# EAGLE design TESTOMATIC-v2_0 (EAGLE 9.7.0)

## Sheet 1 of 4: External Connections
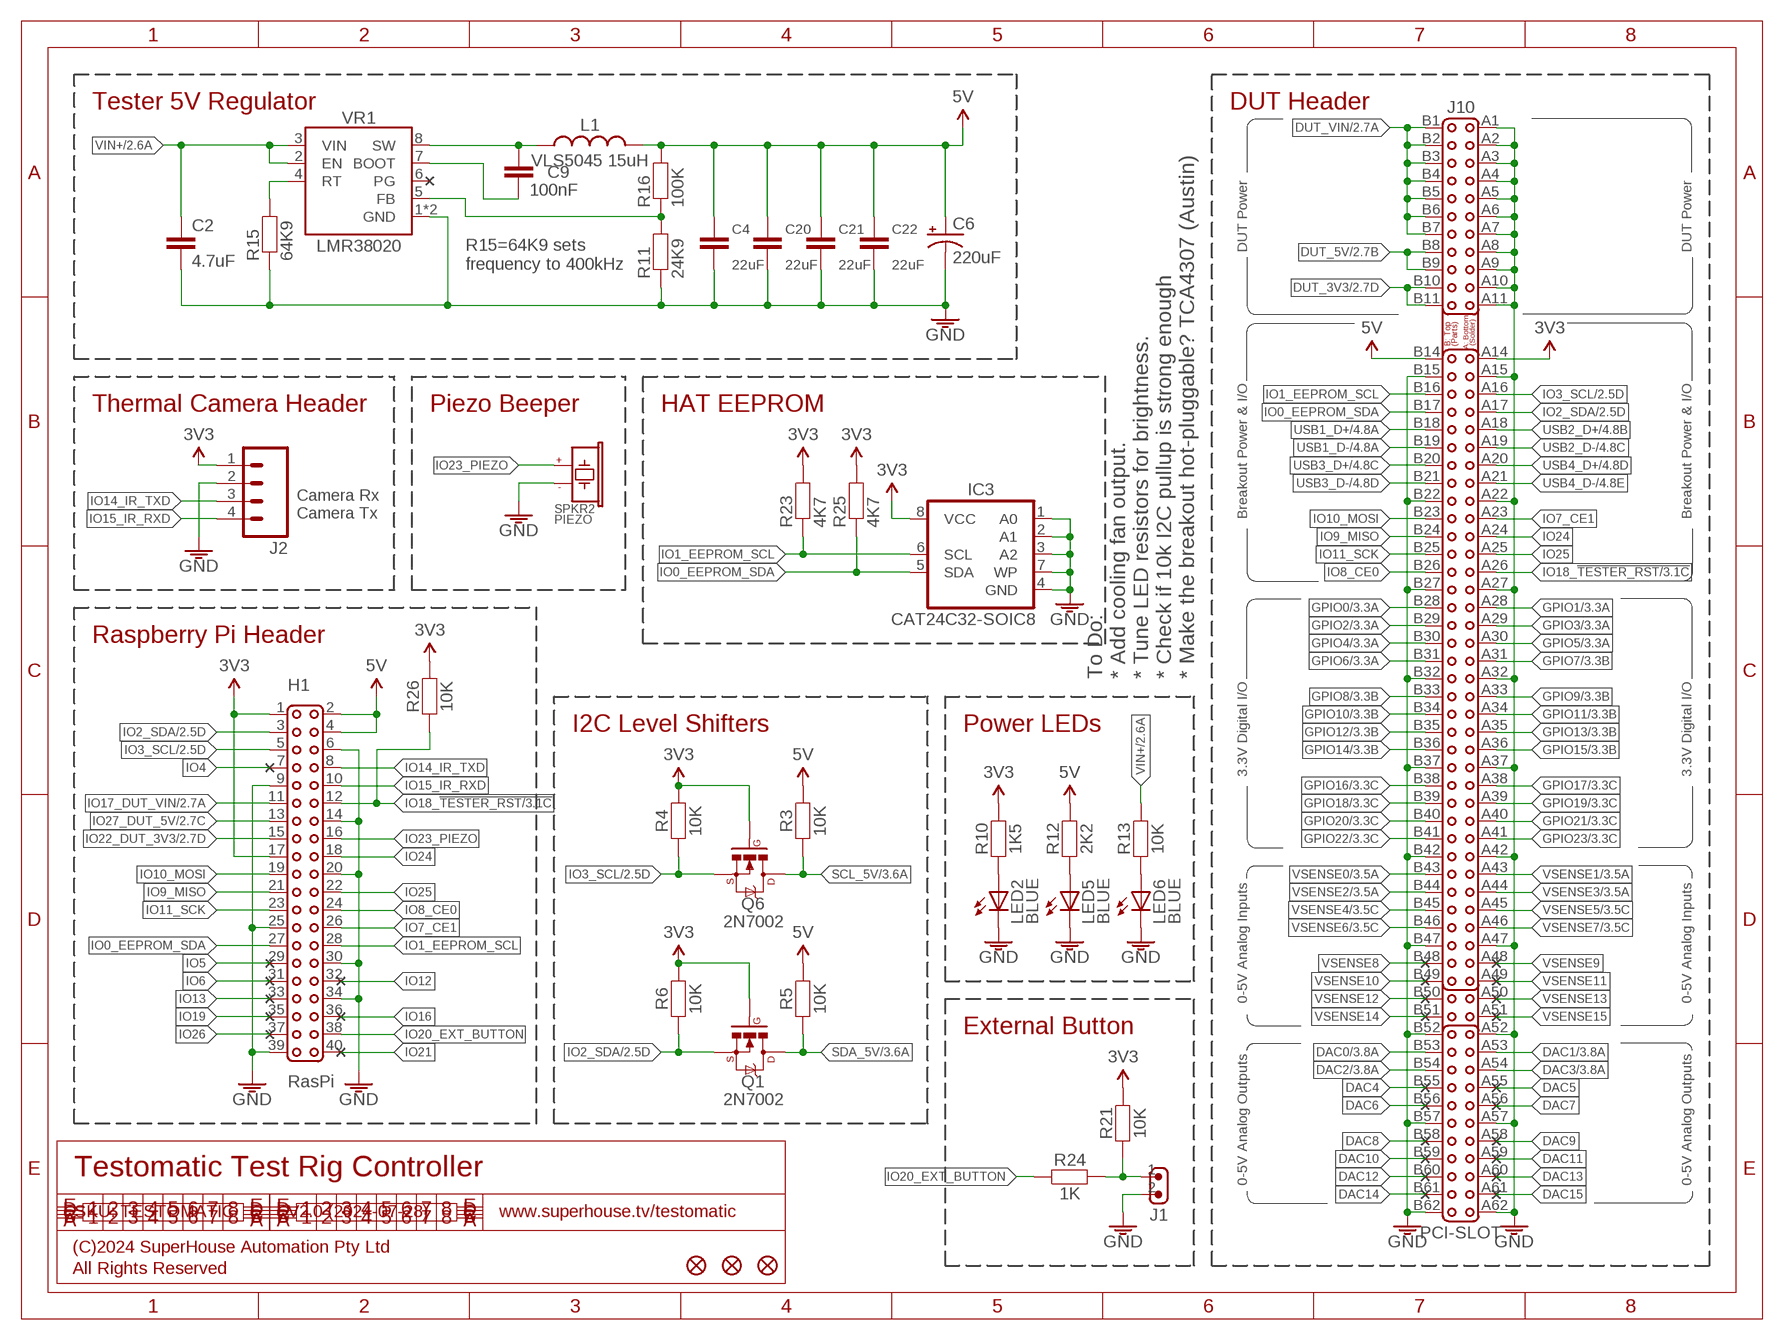
[diagram p0: schematic, sheet 1]

### Parts
C2  4.7uF  CAP1206  [C1206]
C4  22uF  CAP0805  [C0805]
C6  220uF  CAP_POLG  [PANASONIC_G]
C9  100nF  CAP0603  [C0603]
C20  22uF  CAP0805  [C0805]
C21  22uF  CAP0805  [C0805]
C22  22uF  CAP0805  [C0805]
FID1  FIDUCIAL1X2.5  [FIDUCIAL-1X2.5]
FID2  FIDUCIAL1X2.5  [FIDUCIAL-1X2.5]
FID3  FIDUCIAL1X2.5  [FIDUCIAL-1X2.5]
H1  RasPi  M02X20-PIN  [2X20-P]
IC3  CAT24C32-SOIC8  [SOIC8]
J1  M02-B2B-XH  [JST-B2B-XH-A]
J2  M04-B4B-XH  [JST-B4B-XH-A]
J10  PCI-SLOT  [PCI-SLOT]
L1  VLS5045 15uH  INDUCTOR-5045  [INDUCTOR-5045]
LED2  BLUE  LED0603  [LED-0603]
LED5  BLUE  LED0603  [LED-0603]
LED6  BLUE  LED0603  [LED-0603]
Q1  2N7002  MOSFET-NCHANNEL-233  [SOT23-3]
Q6  2N7002  MOSFET-NCHANNEL-233  [SOT23-3]
R3  10K  RESISTOR0603  [R0603]
R4  10K  RESISTOR0603  [R0603]
R5  10K  RESISTOR0603  [R0603]
R6  10K  RESISTOR0603  [R0603]
R10  1K5  RESISTOR0603  [R0603]
R11  24K9  RESISTOR0603  [R0603]
R12  2K2  RESISTOR0603  [R0603]
R13  10K  RESISTOR0603  [R0603]
R15  64K9  RESISTOR0603  [R0603]
R16  100K  RESISTOR0603  [R0603]
R21  10K  RESISTOR0603  [R0603]
R23  4K7  RESISTOR0603  [R0603]
R24  1K  RESISTOR0603  [R0603]
R25  4K7  RESISTOR0603  [R0603]
R26  10K  RESISTOR0603  [R0603]
SPKR2  PIEZO  PIEZOPOLARISED-SMT  [PIEZO-9.6X9.6-SMT]
VR1  LMR38020  LMR38010  [HSOIC8]

### Nets
3.3V: H1.1 H1.17 IC3.8(VCC) J2.1 J10.A14 Q1.1(G) Q6.1(G) R4.2 R6.2 R10.2 R21.2 R23.2 R25.2 R26.2 ; also sheet 2,3,4
5V: C4.1 C6.+ C20.1 C21.1 C22.1 H1.2 H1.4 J10.B14 L1.2 R3.2 R5.2 R12.2 R16.2 ; also sheet 2,3
DAC0: J10.B53 ; also sheet 3
DAC1: J10.A53 ; also sheet 3
DAC2: J10.B54 ; also sheet 3
DAC3: J10.A54 ; also sheet 3
DAC4: J10.B55
DAC5: J10.A55
DAC6: J10.B56
DAC7: J10.A56
DAC8: J10.B58
DAC9: J10.A58
DAC10: J10.B59
DAC11: J10.A59
DAC12: J10.B60
DAC13: J10.A60
DAC14: J10.B61
DAC15: J10.A61
DUT_3V3: J10.B10 J10.B11 ; also sheet 2
DUT_5V: J10.B8 J10.B9 ; also sheet 2
DUT_VIN: J10.B1 J10.B2 J10.B3 J10.B4 J10.B5 J10.B6 J10.B7 ; also sheet 2
GND: C2.2 C4.2 C6.- C20.2 C21.2 C22.2 H1.6 H1.9 H1.14 H1.20 H1.25 H1.30 H1.34 H1.39 IC3.1(A0) IC3.2(A1) IC3.3(A2) IC3.4(GND) IC3.7(WP) J1.2 J2.2 J10.A1 J10.A2 J10.A3 J10.A4 J10.A5 J10.A6 J10.A7 J10.A8 J10.A9 J10.A10 J10.A11 J10.A15 J10.A22 J10.A27 J10.A32 J10.A37 J10.A42 J10.A47 J10.A52 J10.A57 J10.A62 J10.B15 J10.B22 J10.B27 J10.B32 J10.B37 J10.B42 J10.B47 J10.B52 J10.B57 J10.B62 LED2.C LED5.C LED6.C R11.1 R15.1 SPKR2.2(-) VR1.1(GND) VR1.TGND(GND) ; also sheet 2,3,4
GPIO0: J10.B28 ; also sheet 3
GPIO1: J10.A28 ; also sheet 3
GPIO2: J10.B29 ; also sheet 3
GPIO3: J10.A29 ; also sheet 3
GPIO4: J10.B30 ; also sheet 3
GPIO5: J10.A30 ; also sheet 3
GPIO6: J10.B31 ; also sheet 3
GPIO7: J10.A31 ; also sheet 3
GPIO8: J10.B33 ; also sheet 3
GPIO9: J10.A33 ; also sheet 3
GPIO10: J10.B34 ; also sheet 3
GPIO11: J10.A34 ; also sheet 3
GPIO12: J10.B35 ; also sheet 3
GPIO13: J10.A35 ; also sheet 3
GPIO14: J10.B36 ; also sheet 3
GPIO15: J10.A36 ; also sheet 3
GPIO16: J10.B38 ; also sheet 3
GPIO17: J10.A38 ; also sheet 3
GPIO18: J10.B39 ; also sheet 3
GPIO19: J10.A39 ; also sheet 3
GPIO20: J10.B40 ; also sheet 3
GPIO21: J10.A40 ; also sheet 3
GPIO22: J10.B41 ; also sheet 3
GPIO23: J10.A41 ; also sheet 3
IO0_EEPROM_SDA: H1.27 IC3.5(SDA) J10.B17 R25.1
IO1_EEPROM_SCL: H1.28 IC3.6(SCL) J10.B16 R23.1
IO2_SDA: H1.3 J10.A17 Q1.2(S) R6.1 ; also sheet 2,3
IO3_SCL: H1.5 J10.A16 Q6.2(S) R4.1 ; also sheet 2,3
IO4: H1.7
IO5: H1.29
IO6: H1.31
IO7_CE1: H1.26 J10.A23
IO8_CE0: H1.24 J10.B26
IO9_MISO: H1.21 J10.B24
IO10_MOSI: H1.19 J10.B23
IO11_SCK: H1.23 J10.B25
IO12: H1.32
IO13: H1.33
IO14_IR_TXD: H1.8 J2.3
IO15_IR_RXD: H1.10 J2.4
IO16: H1.36
IO17_DUT_VIN: H1.11 ; also sheet 2
IO18_!TESTER_RST: H1.12 J10.A26 R26.1 ; also sheet 3
IO19: H1.35
IO20_EXT_BUTTON: H1.38 R24.1
IO21: H1.40
IO22_DUT_3V3: H1.15 ; also sheet 2
IO23_PIEZO: H1.16 SPKR2.1(+)
IO24: H1.18 J10.A24
IO25: H1.22 J10.A25
IO26: H1.37
IO27_DUT_5V: H1.13 ; also sheet 2
N$2: LED2.A R10.1
N$3: C9.1 L1.1 VR1.8(SW)
N$4: LED5.A R12.1
N$5: LED6.A R13.1
N$9: J1.1 R21.1 R24.2
N$13: R15.2 VR1.4(RT)
N$18: R11.2 R16.1 VR1.5(FB)
N$19: C9.2 VR1.7(BOOT)
SCL_5V: Q6.3(D) R3.1 ; also sheet 3
SDA_5V: Q1.3(D) R5.1 ; also sheet 3
USB1_D+: J10.B18 ; also sheet 4
USB1_D-: J10.B19 ; also sheet 4
USB2_D+: J10.A18 ; also sheet 4
USB2_D-: J10.A19 ; also sheet 4
USB3_D+: J10.B20 ; also sheet 4
USB3_D-: J10.B21 ; also sheet 4
USB4_D+: J10.A20 ; also sheet 4
USB4_D-: J10.A21 ; also sheet 4
VIN+: C2.1 R13.2 VR1.2(EN) VR1.3(VIN) ; also sheet 2
VSENSE0: J10.B43 ; also sheet 3
VSENSE1: J10.A43 ; also sheet 3
VSENSE2: J10.B44 ; also sheet 3
VSENSE3: J10.A44 ; also sheet 3
VSENSE4: J10.B45 ; also sheet 3
VSENSE5: J10.A45 ; also sheet 3
VSENSE6: J10.B46 ; also sheet 3
VSENSE7: J10.A46 ; also sheet 3
VSENSE8: J10.B48
VSENSE9: J10.A48
VSENSE10: J10.B49
VSENSE11: J10.A49
VSENSE12: J10.B50
VSENSE13: J10.A50
VSENSE14: J10.B51
VSENSE15: J10.A51

### Notes on the sheet
- Tester 5V Regulator | DUT Header
- DUT Power | DUT Power
- R15=64K9 sets
  frequency to 400kHz
- Thermal Camera Header | Piezo Beeper | HAT EEPROM
- Camera Rx
- Camera Tx | Breakout Power & I/O | Breakout Power & I/O
- Raspberry Pi Header
- To Do:
  * Add cooling fan output.
  * Tune LED resistors for brightness.
  * Check if 10k I2C pullup is strong enough
  * Make the breakout hot-pluggable? TCA4307 (Austin)
- I2C Level Shifters | Power LEDs
- 3.3V Digital I/O | 3.3V Digital I/O
- 0-5V Analog Inputs | 0-5V Analog Inputs
- External Button
- Testomatic Test Rig Controller
- 0-5V Analog Outputs | 0-5V Analog Outputs
- SKU: TESTOMATIC | V2.0 (2024-07-28) | www.superhouse.tv/testomatic
- (C)2024 SuperHouse Automation Pty Ltd
- All Rights Reserved

## Sheet 2 of 4: DUT Power
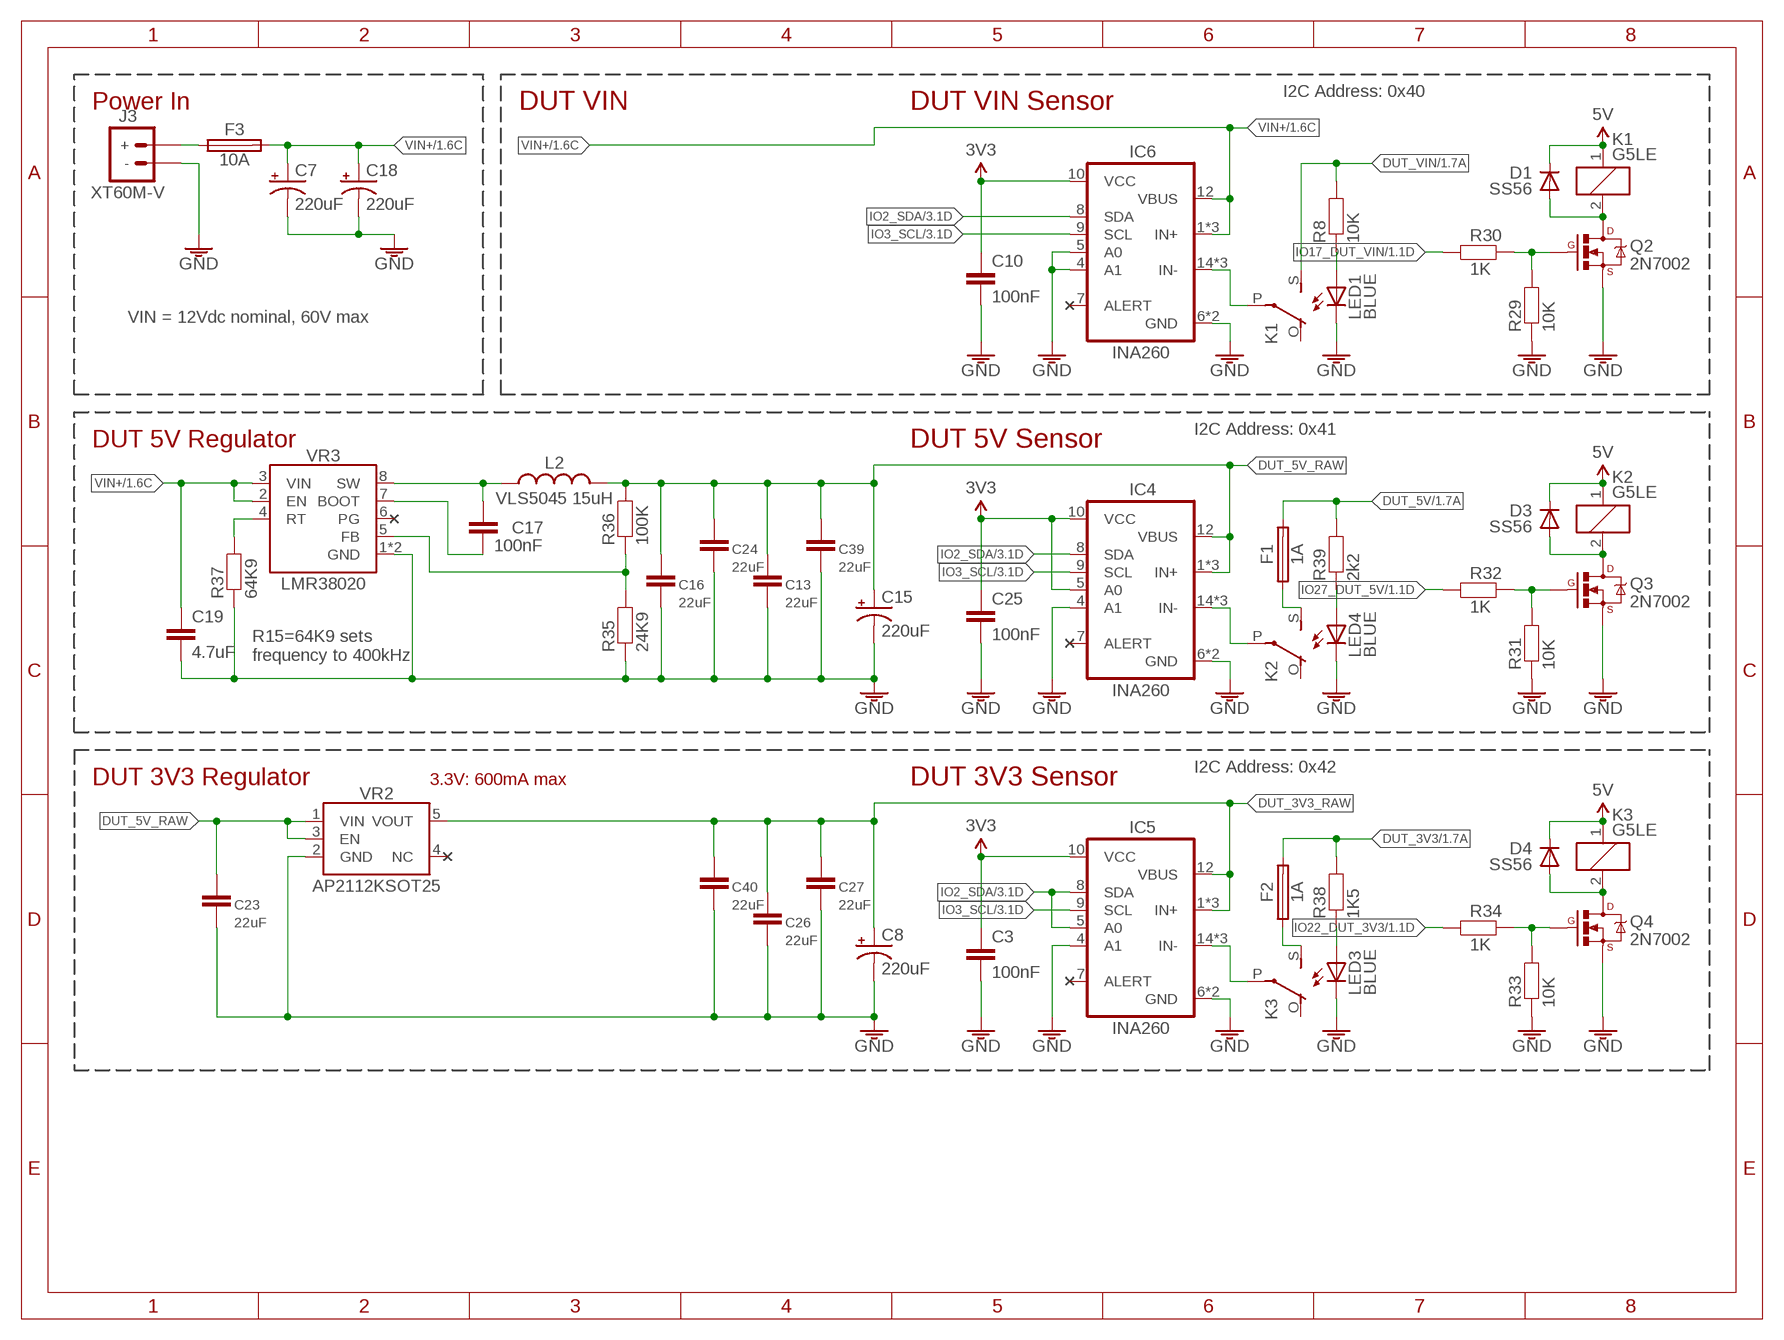
[diagram p1: schematic, sheet 2]

### Parts
C3  100nF  CAP0603  [C0603]
C7  220uF  CAP_POLG  [PANASONIC_G]
C8  220uF  CAP_POLG  [PANASONIC_G]
C10  100nF  CAP0603  [C0603]
C13  22uF  CAP0805  [C0805]
C15  220uF  CAP_POLG  [PANASONIC_G]
C16  22uF  CAP0805  [C0805]
C17  100nF  CAP0603  [C0603]
C18  220uF  CAP_POLG  [PANASONIC_G]
C19  4.7uF  CAP1206  [C1206]
C23  22uF  CAP0805  [C0805]
C24  22uF  CAP0805  [C0805]
C25  100nF  CAP0603  [C0603]
C26  22uF  CAP0805  [C0805]
C27  22uF  CAP0805  [C0805]
C39  22uF  CAP0805  [C0805]
C40  22uF  CAP0805  [C0805]
D1  SS56  DIODESMA  [SMA-DIODE]
D3  SS56  DIODESMA  [SMA-DIODE]
D4  SS56  DIODESMA  [SMA-DIODE]
F1  1A  PTC-1206  [1206]
F2  1A  PTC-1206  [1206]
F3  10A  FUSE-MCCQ  [MCCQ-122]
IC4  INA260  [TSSOP-16]
IC5  INA260  [TSSOP-16]
IC6  INA260  [TSSOP-16]
J3  XT60M-V  XTXX-60M-V  [XT60PW-M-V]
K1  G5LE  SPST  [G5LE]
K2  G5LE  SPDT-G5LE  [G5LE]
K3  G5LE  SPDT-G5LE  [G5LE]
L2  VLS5045 15uH  INDUCTOR-5045  [INDUCTOR-5045]
LED1  BLUE  LED0603  [LED-0603]
LED3  BLUE  LED0603  [LED-0603]
LED4  BLUE  LED0603  [LED-0603]
Q2  2N7002  MOSFET-NCHANNEL-233  [SOT23-3]
Q3  2N7002  MOSFET-NCHANNEL-233  [SOT23-3]
Q4  2N7002  MOSFET-NCHANNEL-233  [SOT23-3]
R8  10K  RESISTOR0603  [R0603]
R29  10K  RESISTOR0603  [R0603]
R30  1K  RESISTOR0603  [R0603]
R31  10K  RESISTOR0603  [R0603]
R32  1K  RESISTOR0603  [R0603]
R33  10K  RESISTOR0603  [R0603]
R34  1K  RESISTOR0603  [R0603]
R35  24K9  RESISTOR0603  [R0603]
R36  100K  RESISTOR0603  [R0603]
R37  64K9  RESISTOR0603  [R0603]
R38  1K5  RESISTOR0603  [R0603]
R39  2k2  RESISTOR0603  [R0603]
VR2  AP2112KSOT25  [SOT23-5]
VR3  LMR38020  LMR38010  [HSOIC8]

### Nets
3.3V: C3.1 C10.1 C25.1 IC4.5(A0) IC4.10(VCC) IC5.10(VCC) IC6.10(VCC) ; also sheet 1,3,4
5V: D1.C D3.C D4.C K1.1 K2.1 K3.1 ; also sheet 1,3
DUT_3V3: F2.2 R38.2 ; also sheet 1
DUT_3V3_RAW: C8.+ C26.1 C27.1 C40.1 IC5.1(IN+) IC5.2(IN+) IC5.3(IN+) IC5.12(VBUS) VR2.5(VOUT)
DUT_5V: F1.2 R39.2 ; also sheet 1
DUT_5V_RAW: C13.1 C15.+ C16.1 C23.1 C24.1 C39.1 IC4.1(IN+) IC4.2(IN+) IC4.3(IN+) IC4.12(VBUS) L2.2 R36.2 VR2.1(VIN) VR2.3(EN)
DUT_VIN: K1.S(2:NO) R8.2 ; also sheet 1
GND: C3.2 C7.- C8.- C10.2 C13.2 C15.- C16.2 C18.- C19.2 C23.2 C24.2 C25.2 C26.2 C27.2 C39.2 C40.2 IC4.4(A1) IC4.6(GND) IC4.11(GND) IC5.4(A1) IC5.6(GND) IC5.11(GND) IC6.4(A1) IC6.5(A0) IC6.6(GND) IC6.11(GND) J3.- LED1.C LED3.C LED4.C Q2.2(S) Q3.2(S) Q4.2(S) R29.1 R31.1 R33.1 R35.1 R37.1 VR2.2(GND) VR3.1(GND) VR3.TGND(GND) ; also sheet 1,3,4
IO2_SDA: IC4.8(SDA) IC5.5(A0) IC5.8(SDA) IC6.8(SDA) ; also sheet 1,3
IO3_SCL: IC4.9(SCL) IC5.9(SCL) IC6.9(SCL) ; also sheet 1,3
IO17_DUT_VIN: R30.1 ; also sheet 1
IO22_DUT_3V3: R34.1 ; also sheet 1
IO27_DUT_5V: R32.1 ; also sheet 1
N$8: F3.1 F3.2 J3.+
N$14: D4.A K3.2 Q4.3(D)
N$15: IC4.14(IN-) IC4.15(IN-) IC4.16(IN-) K2.P(2:COM)
N$16: IC6.14(IN-) IC6.15(IN-) IC6.16(IN-) K1.P(2:COM)
N$17: D1.A K1.2 Q2.3(D)
N$23: LED1.A R8.1
N$24: Q2.1(G) R29.2 R30.2
N$25: F2.1 K3.S(2:NO)
N$26: F1.1 K2.S(2:NO)
N$27: D3.A K2.2 Q3.3(D)
N$28: Q3.1(G) R31.2 R32.2
N$32: Q4.1(G) R33.2 R34.2
N$34: IC5.14(IN-) IC5.15(IN-) IC5.16(IN-) K3.P(2:COM)
N$39: C17.1 L2.1 VR3.8(SW)
N$40: R37.2 VR3.4(RT)
N$41: R35.2 R36.1 VR3.5(FB)
N$42: C17.2 VR3.7(BOOT)
N$43: LED4.A R39.1
N$44: LED3.A R38.1
VIN+: C7.+ C18.+ C19.1 F3.3 F3.4 IC6.1(IN+) IC6.2(IN+) IC6.3(IN+) IC6.12(VBUS) VR3.2(EN) VR3.3(VIN) ; also sheet 1
Unconnected: IC4.7(ALERT) IC5.7(ALERT) IC6.7(ALERT) K1.O(2:NC) K2.O(2:NC) K3.O(2:NC) VR2.4(NC)

### Notes on the sheet
- I2C Address: 0x40
- Power In | DUT VIN | DUT VIN Sensor
- VIN = 12Vdc nominal, 60V max
- I2C Address: 0x41
- DUT 5V Regulator | DUT 5V Sensor
- R15=64K9 sets
  frequency to 400kHz
- I2C Address: 0x42
- DUT 3V3 Regulator | 3.3V: 600mA max | DUT 3V3 Sensor

## Sheet 3 of 4: Digital & Analog I/O
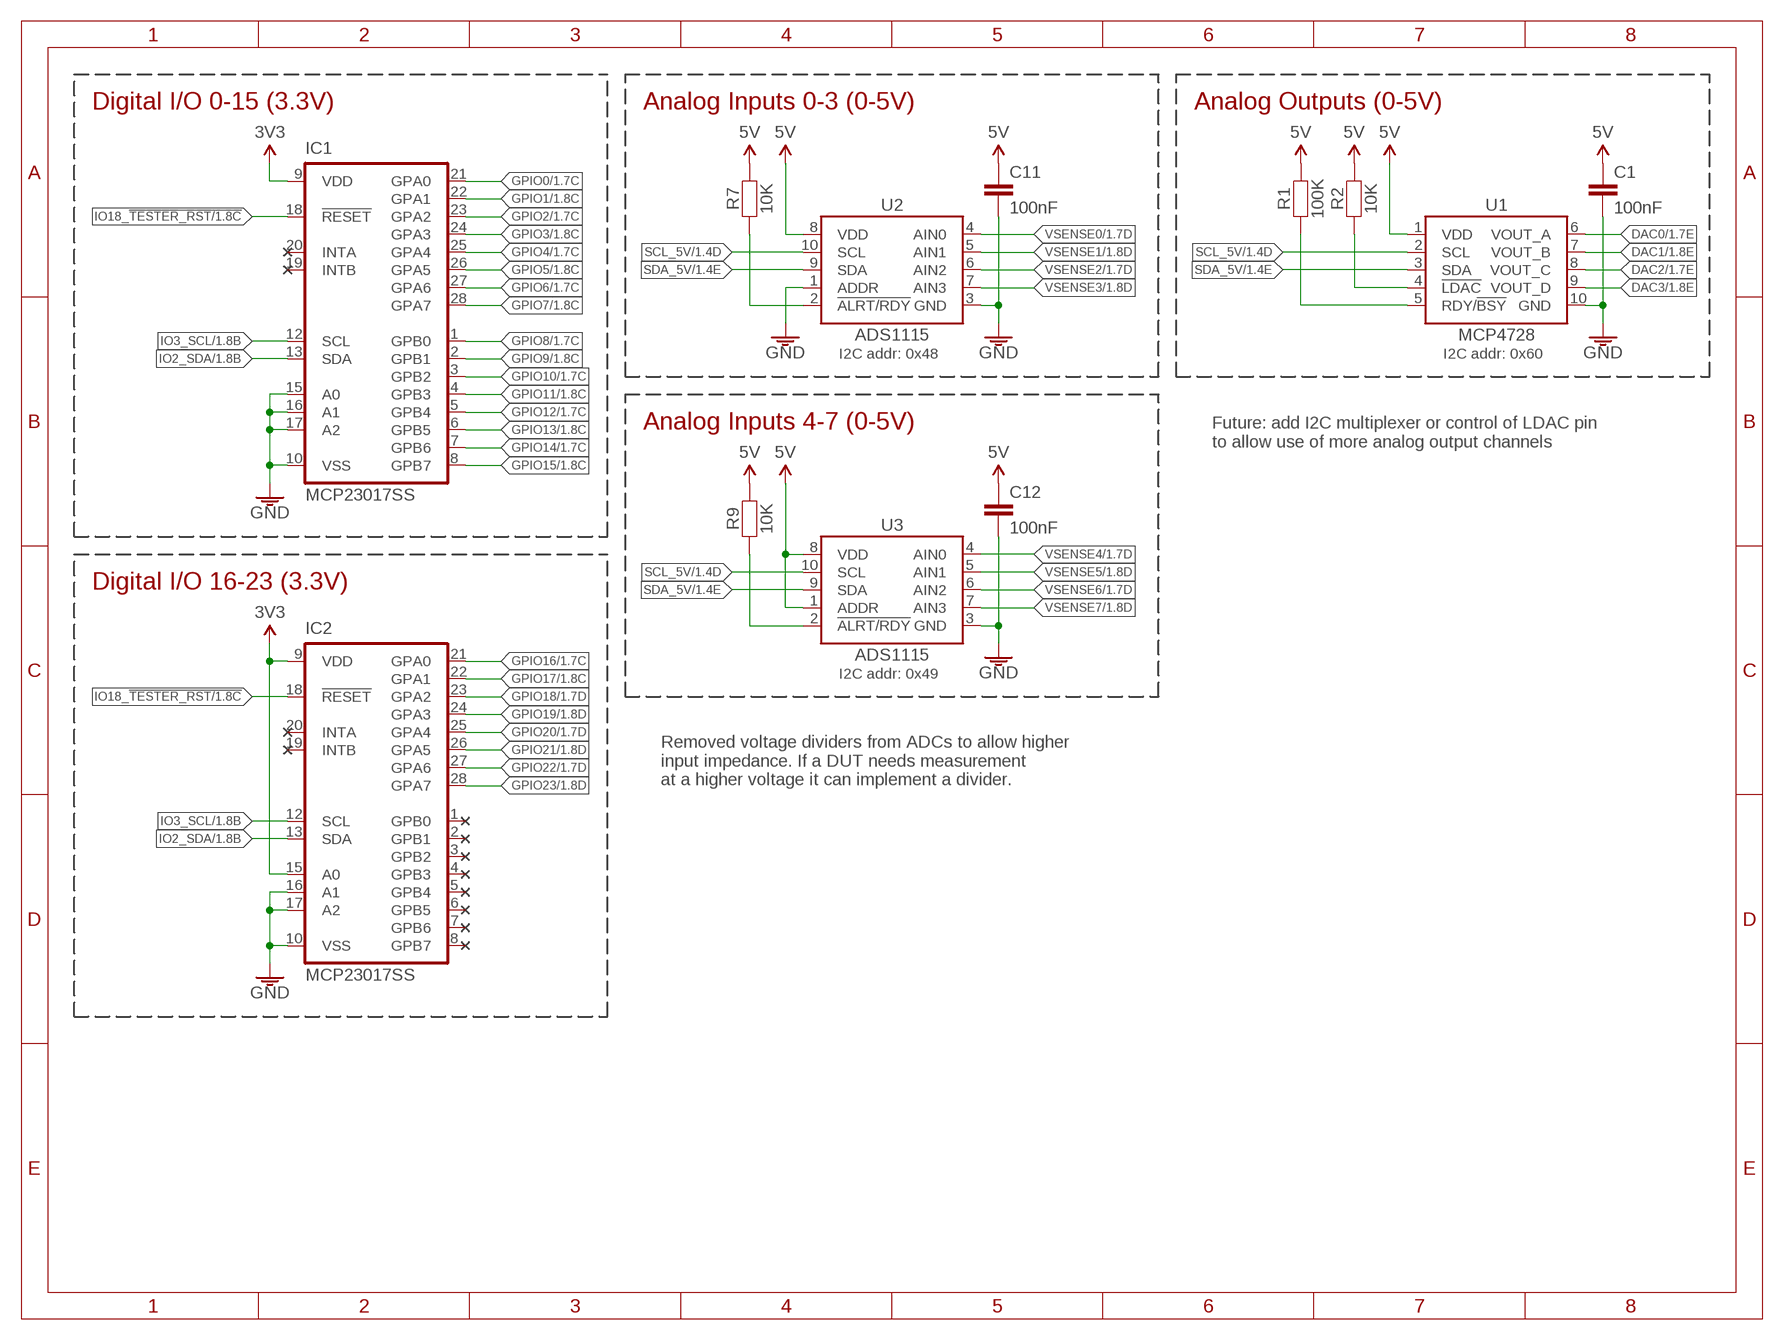
[diagram p2: schematic, sheet 3]

### Parts
C1  100nF  CAP0603  [C0603]
C11  100nF  CAP0603  [C0603]
C12  100nF  CAP0603  [C0603]
IC1  MCP23017SS  [SSOP28]
IC2  MCP23017SS  [SSOP28]
R1  100K  RESISTOR0603  [R0603]
R2  10K  RESISTOR0603  [R0603]
R7  10K  RESISTOR0603  [R0603]
R9  10K  RESISTOR0603  [R0603]
U1  MCP4728  [MSOP10]
U2  ADS1115  [MSOP10]
U3  ADS1115  [MSOP10]

### Nets
3.3V: IC1.9(VDD) IC2.9(VDD) IC2.15(A0) ; also sheet 1,2,4
5V: C1.1 C11.1 C12.1 R1.2 R2.2 R7.2 R9.2 U1.1(VDD) U2.8(VDD) U3.1(ADDR) U3.8(VDD) ; also sheet 1,2
DAC0: U1.6(VOUT_A) ; also sheet 1
DAC1: U1.7(VOUT_B) ; also sheet 1
DAC2: U1.8(VOUT_C) ; also sheet 1
DAC3: U1.9(VOUT_D) ; also sheet 1
GND: C1.2 C11.2 C12.2 IC1.10(VSS) IC1.15(A0) IC1.16(A1) IC1.17(A2) IC2.10(VSS) IC2.16(A1) IC2.17(A2) U1.10(GND) U2.1(ADDR) U2.3(GND) U3.3(GND) ; also sheet 1,2,4
GPIO0: IC1.21(GPA0) ; also sheet 1
GPIO1: IC1.22(GPA1) ; also sheet 1
GPIO2: IC1.23(GPA2) ; also sheet 1
GPIO3: IC1.24(GPA3) ; also sheet 1
GPIO4: IC1.25(GPA4) ; also sheet 1
GPIO5: IC1.26(GPA5) ; also sheet 1
GPIO6: IC1.27(GPA6) ; also sheet 1
GPIO7: IC1.28(GPA7) ; also sheet 1
GPIO8: IC1.1(GPB0) ; also sheet 1
GPIO9: IC1.2(GPB1) ; also sheet 1
GPIO10: IC1.3(GPB2) ; also sheet 1
GPIO11: IC1.4(GPB3) ; also sheet 1
GPIO12: IC1.5(GPB4) ; also sheet 1
GPIO13: IC1.6(GPB5) ; also sheet 1
GPIO14: IC1.7(GPB6) ; also sheet 1
GPIO15: IC1.8(GPB7) ; also sheet 1
GPIO16: IC2.21(GPA0) ; also sheet 1
GPIO17: IC2.22(GPA1) ; also sheet 1
GPIO18: IC2.23(GPA2) ; also sheet 1
GPIO19: IC2.24(GPA3) ; also sheet 1
GPIO20: IC2.25(GPA4) ; also sheet 1
GPIO21: IC2.26(GPA5) ; also sheet 1
GPIO22: IC2.27(GPA6) ; also sheet 1
GPIO23: IC2.28(GPA7) ; also sheet 1
IO2_SDA: IC1.13(SDA) IC2.13(SDA) ; also sheet 1,2
IO3_SCL: IC1.12(SCL) IC2.12(SCL) ; also sheet 1,2
IO18_!TESTER_RST: IC1.18(!RESET) IC2.18(!RESET) ; also sheet 1
N$1: R7.1 U2.2(!ALRT/RDY)
N$12: R9.1 U3.2(!ALRT/RDY)
N$21: R2.1 U1.4(!LDAC)
N$22: R1.1 U1.5(RDY/!BSY)
SCL_5V: U1.2(SCL) U2.10(SCL) U3.10(SCL) ; also sheet 1
SDA_5V: U1.3(SDA) U2.9(SDA) U3.9(SDA) ; also sheet 1
VSENSE0: U2.4(AIN0) ; also sheet 1
VSENSE1: U2.5(AIN1) ; also sheet 1
VSENSE2: U2.6(AIN2) ; also sheet 1
VSENSE3: U2.7(AIN3) ; also sheet 1
VSENSE4: U3.4(AIN0) ; also sheet 1
VSENSE5: U3.5(AIN1) ; also sheet 1
VSENSE6: U3.6(AIN2) ; also sheet 1
VSENSE7: U3.7(AIN3) ; also sheet 1
Unconnected: IC1.19(INTB) IC1.20(INTA) IC2.1(GPB0) IC2.2(GPB1) IC2.3(GPB2) IC2.4(GPB3) IC2.5(GPB4) IC2.6(GPB5) IC2.7(GPB6) IC2.8(GPB7) IC2.19(INTB) IC2.20(INTA)

### Notes on the sheet
- Digital I/O 0-15 (3.3V) | Analog Inputs 0-3 (0-5V) | Analog Outputs (0-5V)
- I2C addr: 0x48 | I2C addr: 0x60
- Analog Inputs 4-7 (0-5V)
- Future: add I2C multiplexer or control of LDAC pin
  to allow use of more analog output channels
- Digital I/O 16-23 (3.3V)
- I2C addr: 0x49
- Removed voltage dividers from ADCs to allow higher
  input impedance. If a DUT needs measurement
  at a higher voltage it can implement a divider.

## Sheet 4 of 4: USB Connections
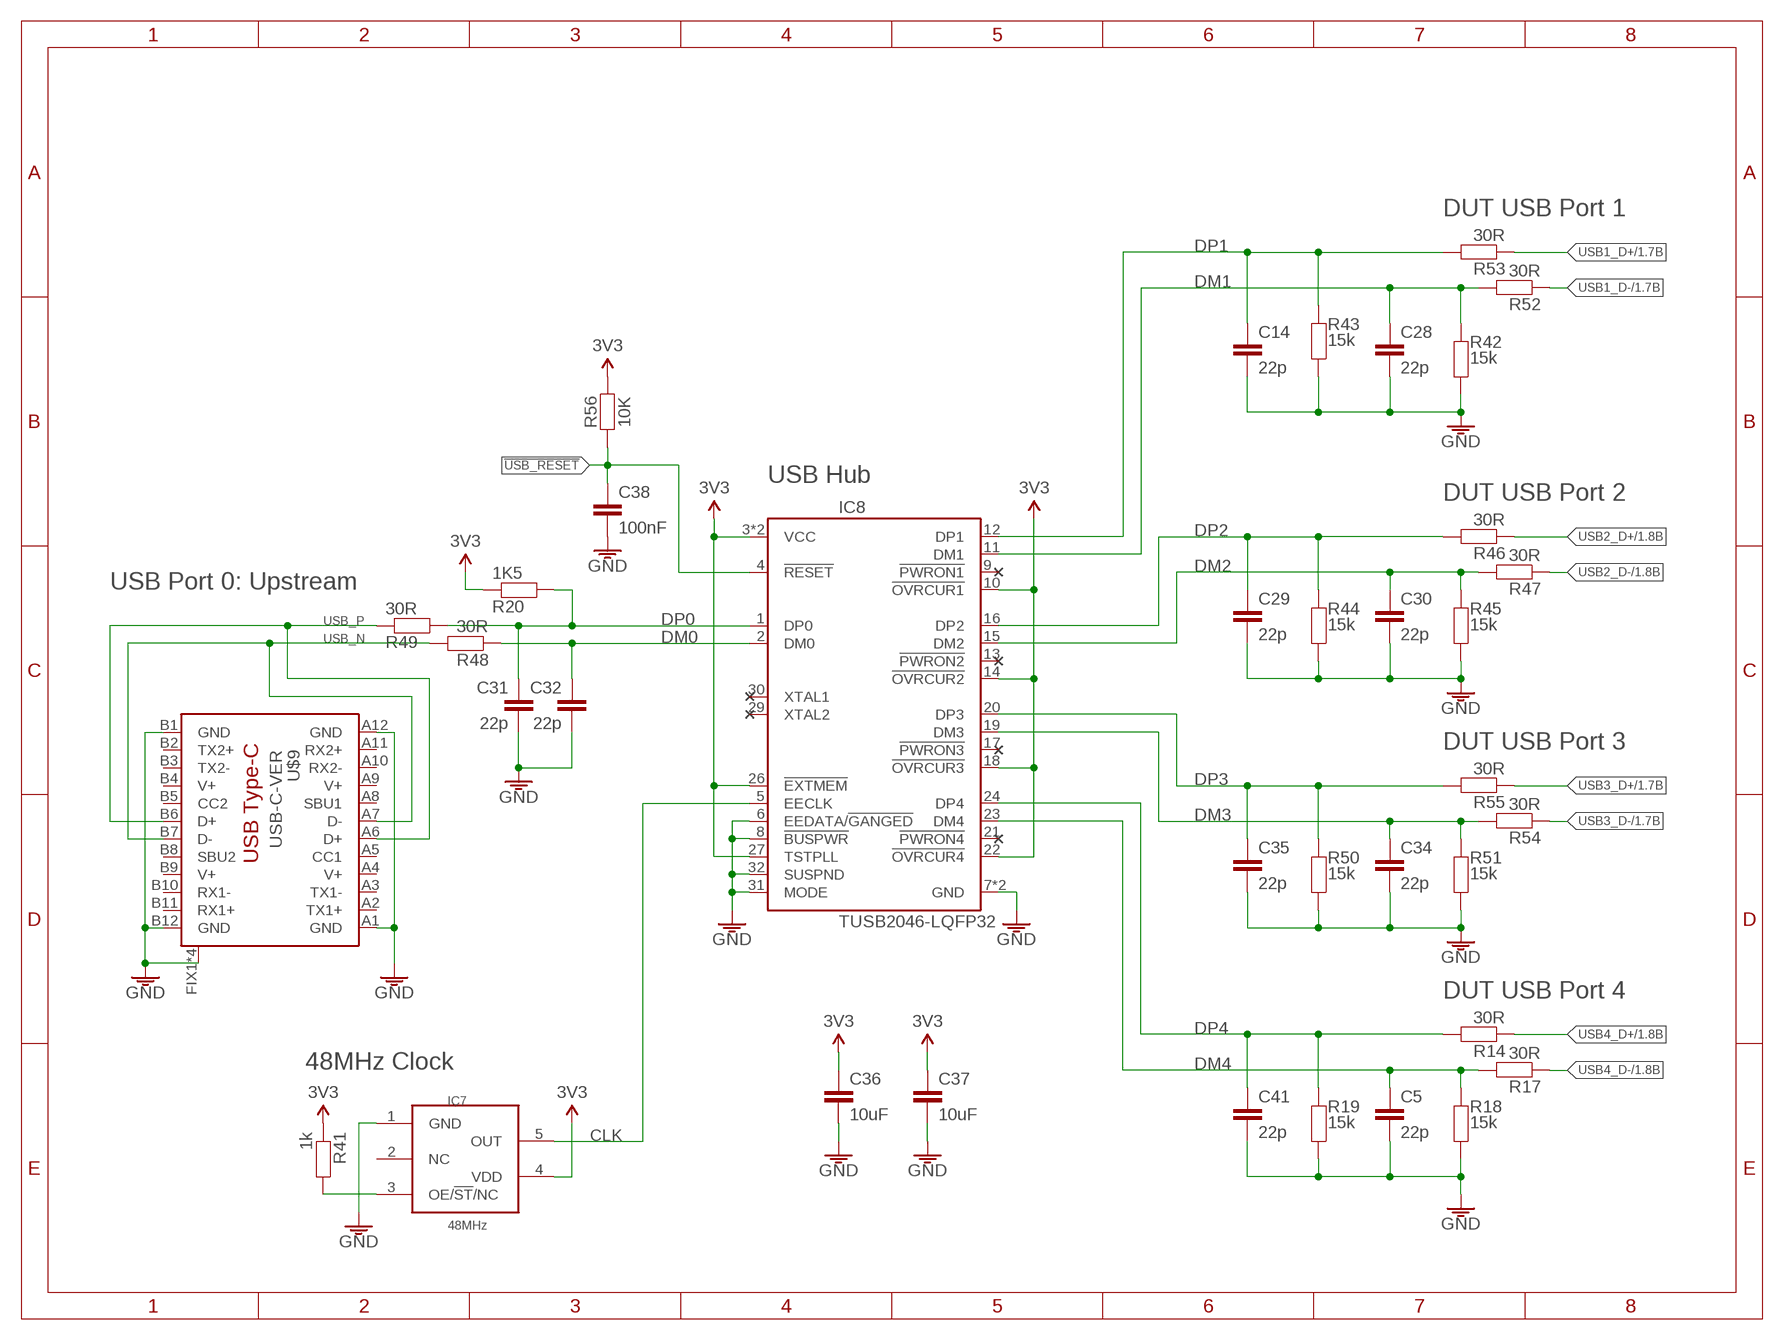
[diagram p3: schematic, sheet 4]

### Parts
C5  22p  CAP0603  [C0603]
C14  22p  CAP0603  [C0603]
C28  22p  CAP0603  [C0603]
C29  22p  CAP0603  [C0603]
C30  22p  CAP0603  [C0603]
C31  22p  CAP0603  [C0603]
C32  22p  CAP0603  [C0603]
C34  22p  CAP0603  [C0603]
C35  22p  CAP0603  [C0603]
C36  10uF  CAP0805  [C0805]
C37  10uF  CAP0805  [C0805]
C38  100nF  CAP0603  [C0603]
C41  22p  CAP0603  [C0603]
IC7  48MHz  SIT2001BSOT-23-5  [SOT-23-5]
IC8  TUSB2046-LQFP32  [LQFP32]
R14  30R  RESISTOR0603  [R0603]
R17  30R  RESISTOR0603  [R0603]
R18  15k  RESISTOR0603  [R0603]
R19  15k  RESISTOR0603  [R0603]
R20  1K5  RESISTOR0603  [R0603]
R41  1k  RESISTOR0603  [R0603]
R42  15k  RESISTOR0603  [R0603]
R43  15k  RESISTOR0603  [R0603]
R44  15k  RESISTOR0603  [R0603]
R45  15k  RESISTOR0603  [R0603]
R46  30R  RESISTOR0603  [R0603]
R47  30R  RESISTOR0603  [R0603]
R48  30R  RESISTOR0603  [R0603]
R49  30R  RESISTOR0603  [R0603]
R50  15k  RESISTOR0603  [R0603]
R51  15k  RESISTOR0603  [R0603]
R52  30R  RESISTOR0603  [R0603]
R53  30R  RESISTOR0603  [R0603]
R54  30R  RESISTOR0603  [R0603]
R55  30R  RESISTOR0603  [R0603]
R56  10K  RESISTOR0603  [R0603]
U$9  USB-C-VER  [USB-C-VERT]

### Nets
3.3V: C36.1 C37.1 IC7.4(VDD) IC8.3(VCC) IC8.10(!OVRCUR1) IC8.14(!OVRCUR2) IC8.18(!OVRCUR3) IC8.22(!OVRCUR4) IC8.25(VCC) IC8.26(!EXTMEM) IC8.27(TSTPLL) R20.1 R41.1 R56.2 ; also sheet 1,2,3
!USB_RESET: C38.1 IC8.4(!RESET) R56.1
CLK: IC7.5(OUT) IC8.5(EECLK)
DM0: C32.1 IC8.2(DM0) R48.2
DM1: C28.1 IC8.11(DM1) R42.1 R52.2
DM2: C30.1 IC8.15(DM2) R45.1 R47.2
DM3: C34.1 IC8.19(DM3) R51.1 R54.2
DM4: C5.1 IC8.23(DM4) R17.2 R18.1
DP0: C31.1 IC8.1(DP0) R20.2 R49.2
DP1: C14.1 IC8.12(DP1) R43.1 R53.2
DP2: C29.1 IC8.16(DP2) R44.1 R46.2
DP3: C35.1 IC8.20(DP3) R50.1 R55.2
DP4: C41.1 IC8.24(DP4) R14.2 R19.1
GND: C5.2 C14.2 C28.2 C29.2 C30.2 C31.2 C32.2 C34.2 C35.2 C36.2 C37.2 C38.2 C41.2 IC7.1(GND) IC8.6(EEDATA/!GANGED) IC8.7(GND) IC8.8(!BUSPWR) IC8.28(GND) IC8.31(MODE) IC8.32(SUSPND) R18.2 R19.2 R42.2 R43.2 R44.2 R45.2 R50.2 R51.2 U$9.A1(GND) U$9.A12(GND) U$9.B1(GND) U$9.B12(GND) U$9.FIX1(CASE) U$9.FIX2(CASE) U$9.FIX3(CASE) U$9.FIX4(CASE) ; also sheet 1,2,3
N$46: IC7.3(OE/!ST!/NC) R41.2
USB1_D+: R53.1 ; also sheet 1
USB1_D-: R52.1 ; also sheet 1
USB2_D+: R46.1 ; also sheet 1
USB2_D-: R47.1 ; also sheet 1
USB3_D+: R55.1 ; also sheet 1
USB3_D-: R54.1 ; also sheet 1
USB4_D+: R14.1 ; also sheet 1
USB4_D-: R17.1 ; also sheet 1
USB_N: R48.1 U$9.A7(D-) U$9.B7(D-)
USB_P: R49.1 U$9.A6(D+) U$9.B6(D+)
Unconnected: IC7.2(NC) IC8.9(!PWRON1) IC8.13(!PWRON2) IC8.17(!PWRON3) IC8.21(!PWRON4) IC8.29(XTAL2) IC8.30(XTAL1) U$9.A2(TX1+) U$9.A3(TX1-) U$9.A5(CC1) U$9.A8(SBU1) U$9.A10(RX2-) U$9.A11(RX2+) U$9.B2(TX2+) U$9.B3(TX2-) U$9.B5(CC2) U$9.B8(SBU2) U$9.B10(RX1-) U$9.B11(RX1+)

### Notes on the sheet
- DUT USB Port 1
- USB Hub
- DUT USB Port 2
- USB Port 0: Upstream
- DUT USB Port 3
- DUT USB Port 4
- 48MHz Clock

## Power pins joined to a net without a drawn wire
PG: VR1.6(PG) VR3.6(PG)
V+: U$9.A4(V+) U$9.A9(V+) U$9.B4(V+) U$9.B9(V+)

## Library data of the parts
C1-C5 C9-C14 C16 C17 C19-C30 C34-C37 C39-C41 = SuperHouse-Capacitors:CAP: Capacitor Standard ceramic capacitor
C6-C8 C15 C18 = SuperHouse-Capacitors:CAP_POL: Capacitor Polarized These are standard SMD and PTH capacitors. Normally 10uF, 47uF, and 100uF in electrolytic and tantalum varieties. Always verify the external diameter of the through hole cap, it varies with capacity, voltage, and manufacturer. The EIA devices should be standard.
C31 C32 C38 = SuperHouse-DiscreteSemi:CAP: Capacitor Standard ceramic capacitor
D1 D3 D4 = SuperHouse-Diodes:DIODE: Diode Standard reverse protection diodes and small signal diodes. SMA package can handle up to about 1A. SOD-323 can handle about 200mA.
F1 F2 = SuperHouse-Fuses:PTC: Resettable polyfuses
F3 = SuperHouse-Fuses:FUSE: Fuse
FID1-FID3 = SuperHouse-Symbols:FIDUCIAL: Fiducial Alignment Points Various fiducial points for machine vision alignment.
H1 = SuperHouse-Connectors:M02X20: M40 header in 2x20 format
IC1 IC2 = SuperHouse-ICs:MCP23017: http://ww1.microchip.com/downloads/en/DeviceDoc/21952a.pdf Source: http://ww1.microchip.com/downloads/en/DeviceDoc/21952a.pdf
IC3 = SuperHouse-ICs:CAT24C32
IC4-IC6 = SuperHouse-Sensors:INA260: INA260 current / voltage sensor
IC7 = my library:SIT2001B
IC8 = SuperHouse-ICs:TUSB2046
J1 = SuperHouse-Connectors:M02: 2-way header Standard 1x2 header, and screw terminal variations
J2 = SuperHouse-Connectors:M04: 4-way header Standard 1x4 header, and screw terminal variations
J3 = SuperHouse-Connectors:XTXX: XT30/60/90 connector
J10 = SuperHouse-Connectors:PCI
K1 = SuperHouse-Relays:SPST: SPST relay in various packages: Omron G5LE; OC_FARNELL: unknown; OC_NEWARK: unknown
K2 K3 = SuperHouse-Relays:SPDT: SPST relay in various packages: Omron G5LE; OC_FARNELL: unknown; OC_NEWARK: unknown
L1 L2 = SuperHouse-Inductors:INDUCTOR: INDUCTOR, American symbol
LED1-LED6 = SuperHouse-LEDs:LED: LEDs in various sizes including 5mm and 3mm PTH, and 0402, 0603, 0805, etc SMT
Q1-Q4 Q6 = SuperHouse-Transistors:MOSFET-NCHANNEL: N-channel MOSFET
R1-R13 R15 R16 R21 R23-R26 R29-R39 R56 = SuperHouse-Resistors:RESISTOR: Resistors in both surface-mount and through-hole versions.
R14 R17-R20 R41-R55 = SuperHouse-DiscreteSemi:RESISTOR: Resistor Standard resistors.
SPKR2 = SuperHouse-Audio:PIEZOPOLARISED
U1 = SuperHouse-ICs:MCP4728
U2 U3 = SuperHouse-ICs:ADS1115
U$9 = SuperHouse-Connectors:USB-C
VR1 VR3 = SuperHouse-Regulators:LMR38010
VR2 = SuperHouse-Regulators:AP2112K: AP2112K LDO linear voltage regulator

## Net classes
0 Default: width 0.203 mm
1 VCC: width 0.305 mm

## Board
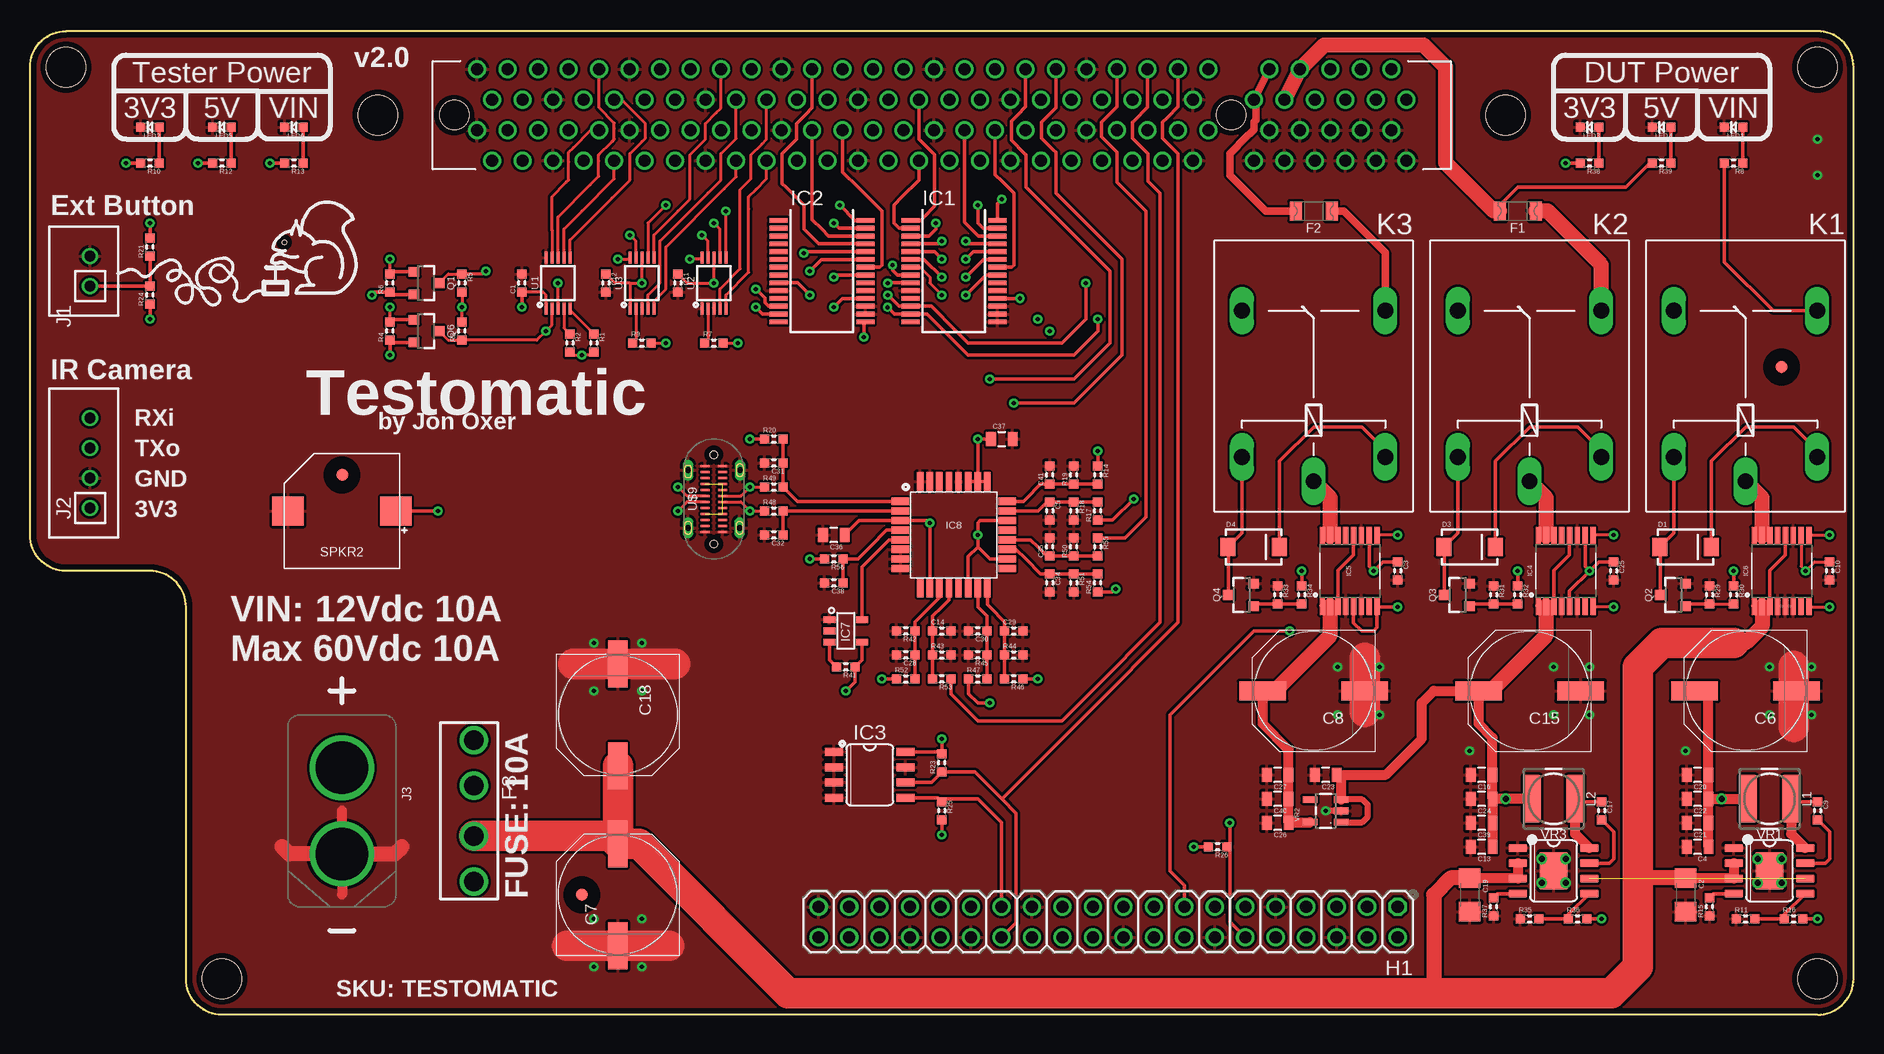
[diagram p4: board, top side]
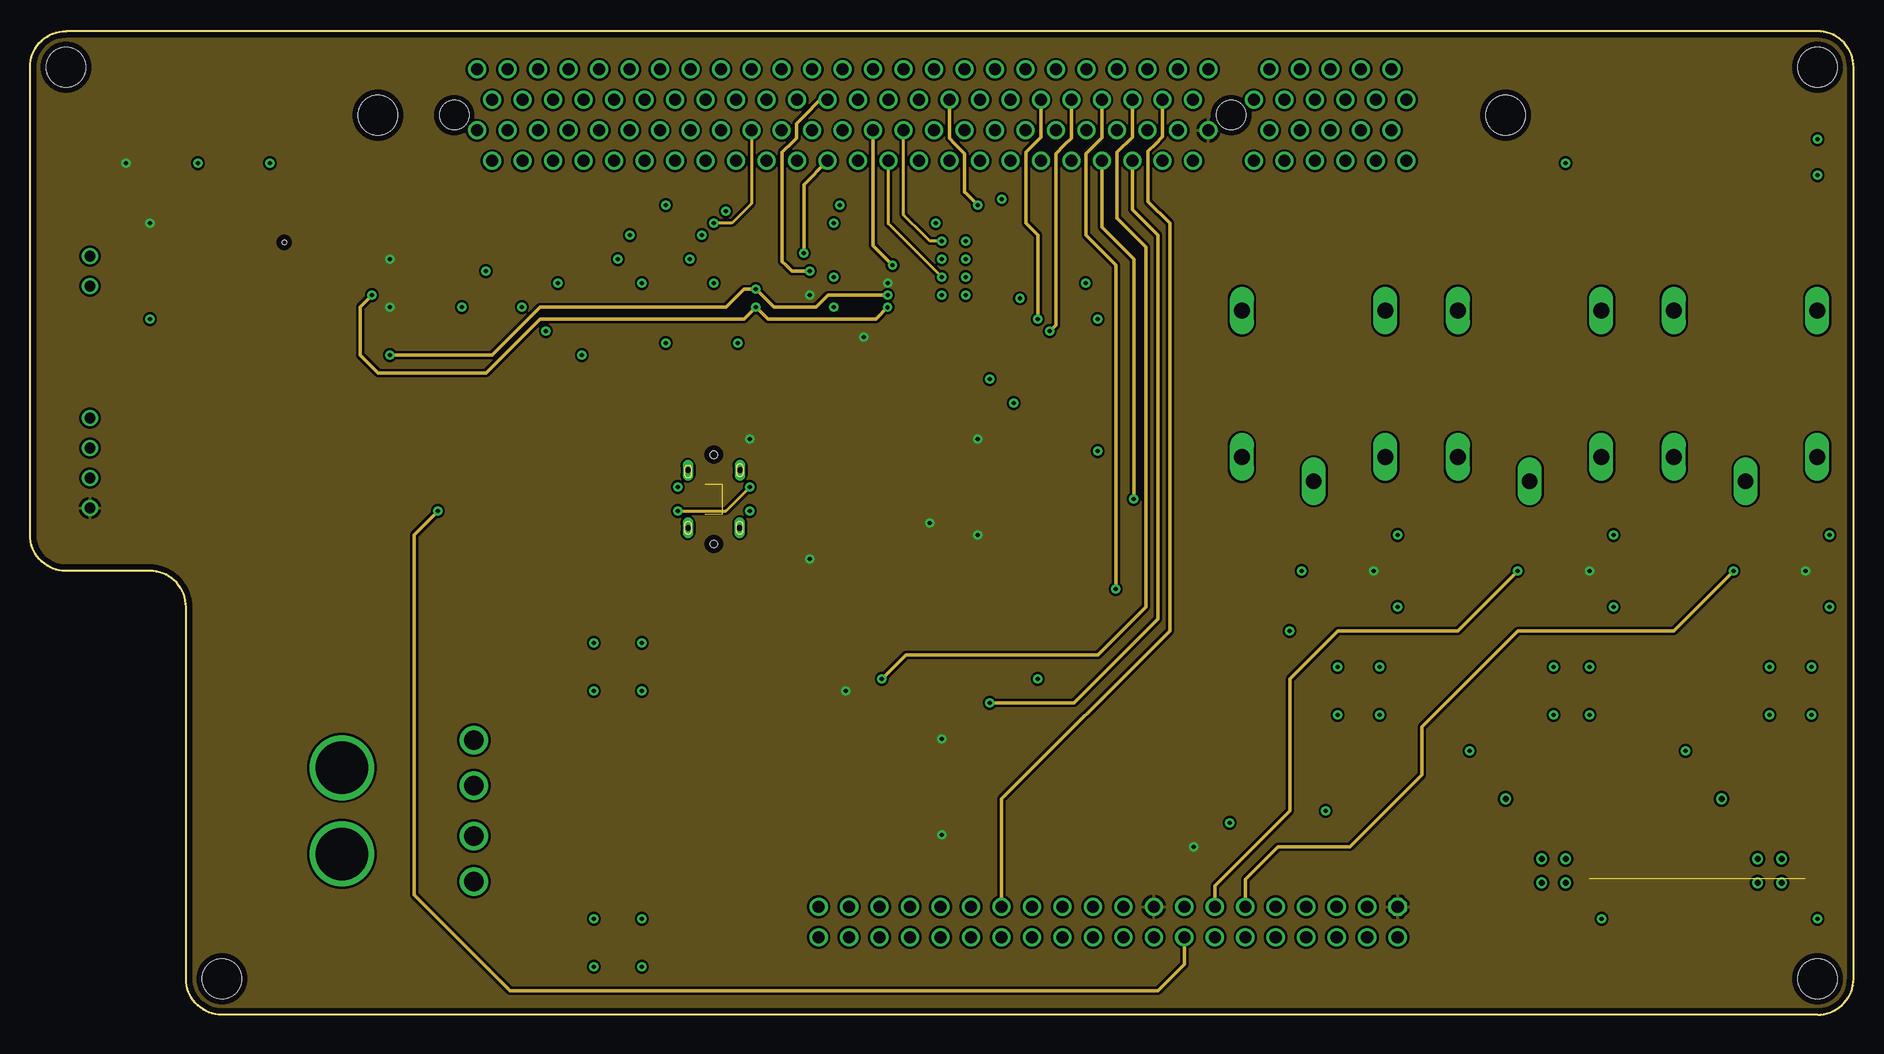
[diagram p5: board, inner layer Route2]
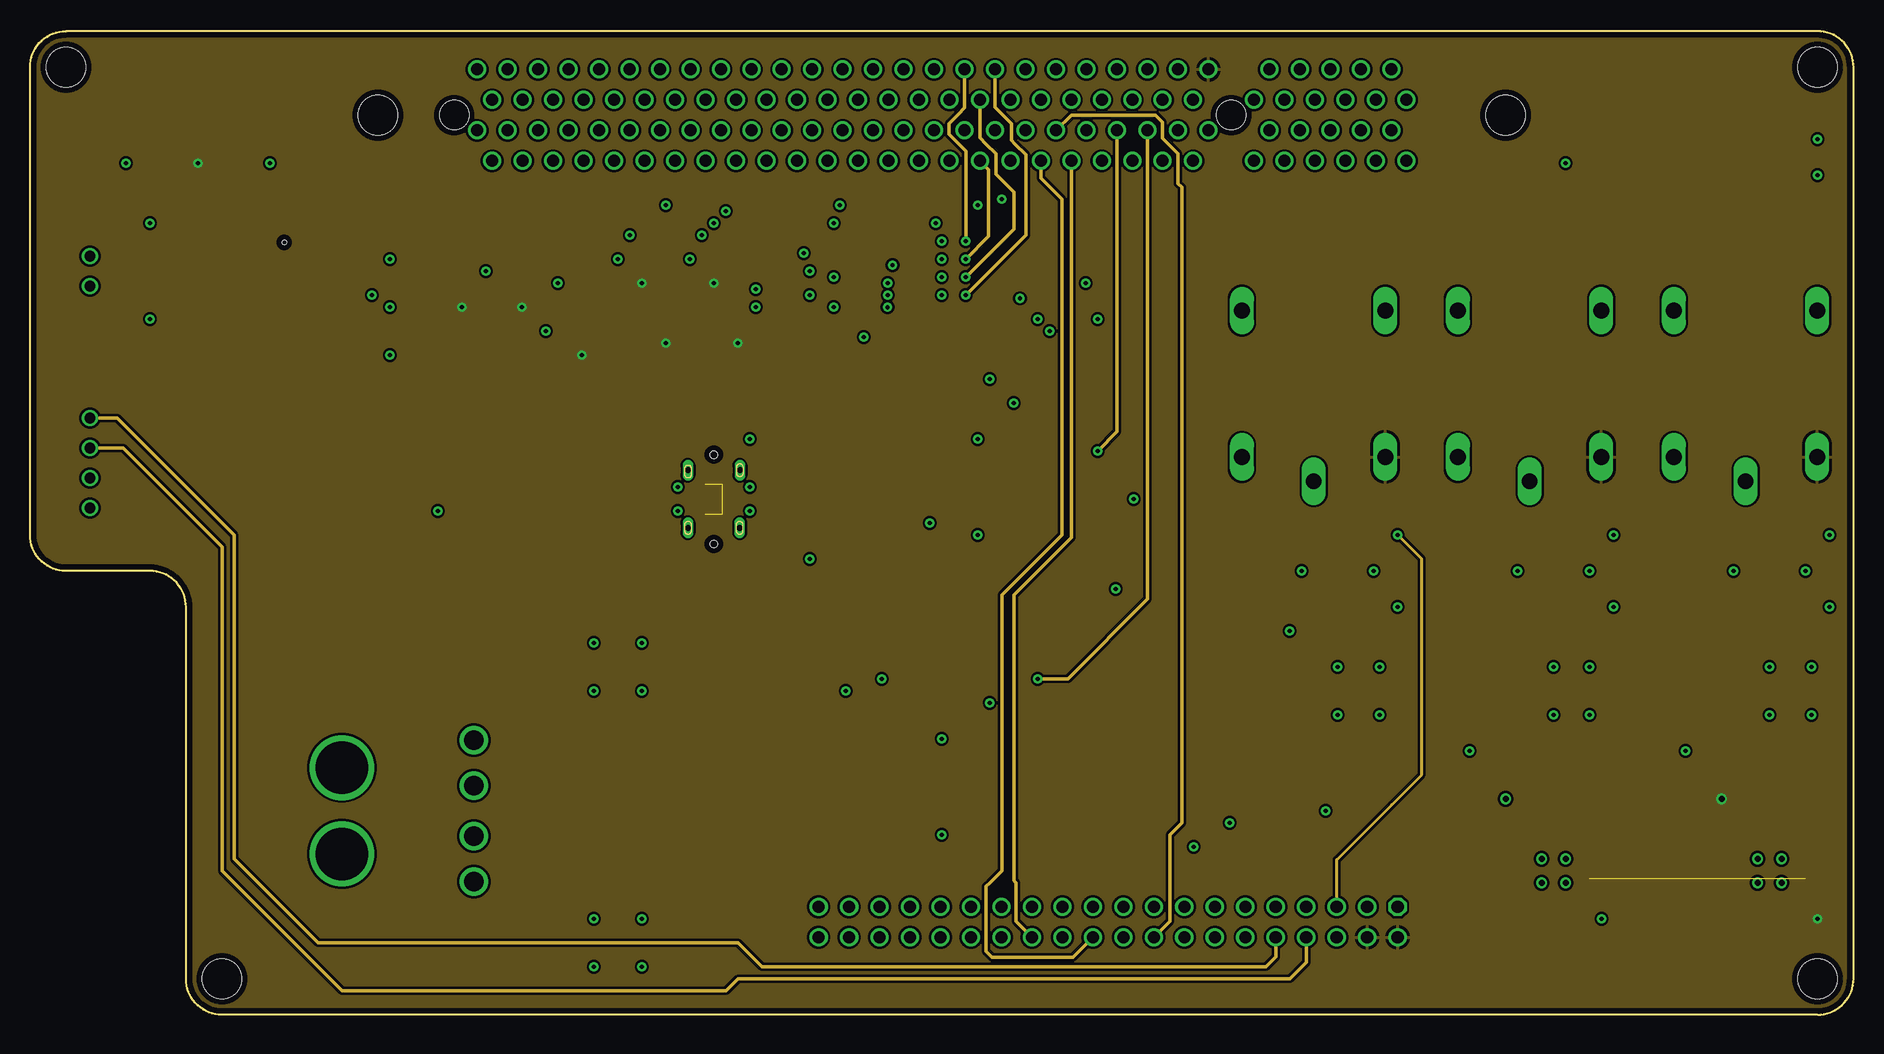
[diagram p6: board, inner layer Route15]
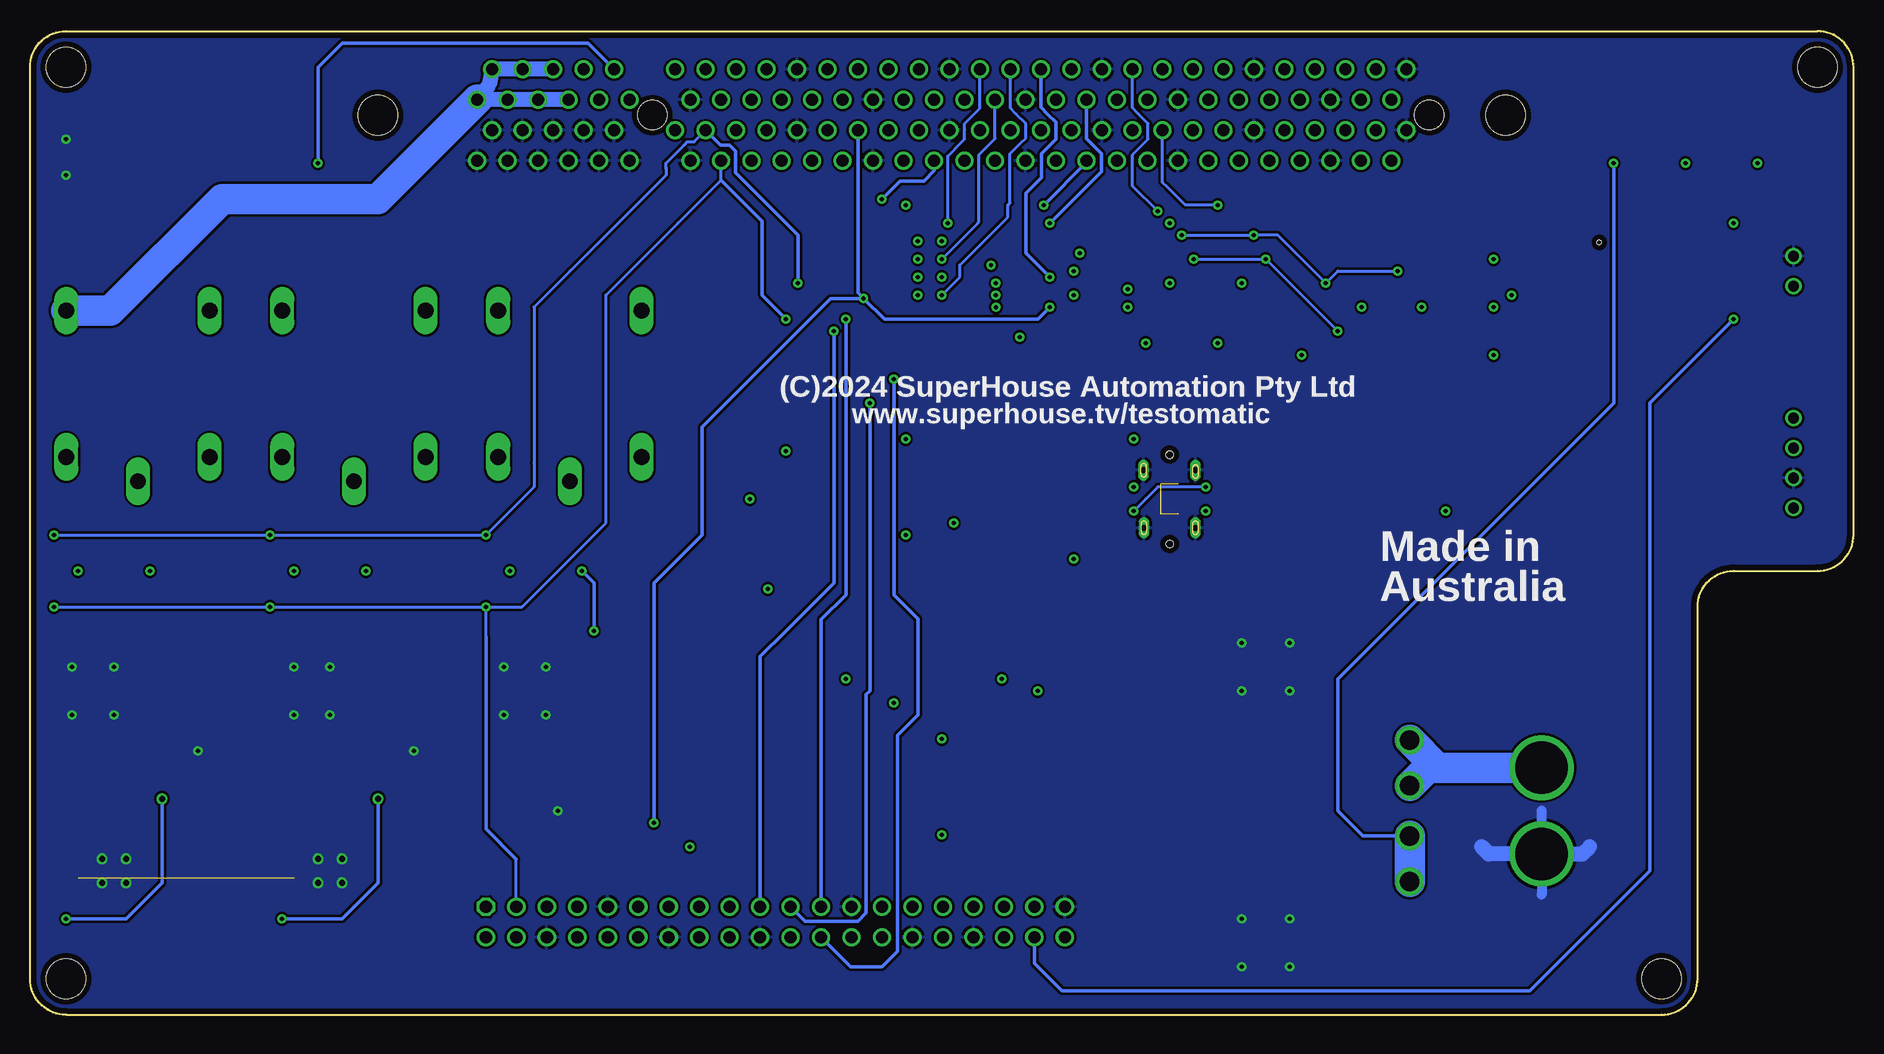
[diagram p7: board, bottom side, seen from below]

Size 152 x 82 mm. Coordinates in mm from the lower left corner, seen from the top.
Outline: 149,0 16,0 arc-90 13,3 13,34 arc90 10,37 3,37 arc-90 0,40 0,79 arc-90 3,82 149,82 arc-90 152,79 152,3 arc-90 149,0
Copper layers (1+2*15+16): Top 0.035mm / dielectric 1.5mm / Route2 0.035mm / dielectric 0.15mm / Route15 0.035mm / dielectric 0.2mm / Bottom 0.035mm
Design rules "SuperHouse-Design-Rules *": minimum track width 10mil, minimum drill 24mil, track to track 8mil, track to pad 8mil, pad to pad 8mil, via to via 8mil, smd to smd 6mil, copper to edge 18mil, drill to drill 8mil, minimum pad ring 7mil, minimum via ring 8mil, stop-mask expansion 4mil, vias tented up to drill 0.5mm, thermal gap 10mil
Holes 0.35 mm at 21.2,64.4
Holes 3.3 mm at 149,79 149,3 16,3 3,79 29,75 123,75
tRestrict: area 145,53 to 147,55; area 45,9 to 47,11; area 25,44 to 27,46

### Footprints (pad centres in the part's own frame; a part is rotated, then mirrored left to right if it is on the bottom)
C0603 = smd 0.762 x 0.762: 1 -0.762,0; 2 0.762,0
C1206 = smd 1.6 x 1.8: 1 -1.4,0; 2 1.4,0
C0805 = smd 0.8 x 1.2: 1 -0.9,0; 2 0.9,0
PANASONIC_G = smd 3.9 x 1.6: + 4.25,0; - -4.25,0
SMA-DIODE = smd 1.27 x 1.47: A -2.15,0; C 2.15,0
1206 = smd 1 x 1.6: 1 -1.5,0; 2 1.5,0
MCCQ-122 = drill 1.6: 1 -5.9,0; 2 -2.1,0; 3 2.1,0; 4 5.9,0
FIDUCIAL-1X2.5 = smd 1 x 1: 1 0,0
2X20-P = drill 1.016 octagon: 1 0,0 | drill 1.016: 2 0,2.54; 3 2.54,0; 4 2.54,2.54; 5 5.08,0; 6 5.08,2.54; 7 7.62,0; 8 7.62,2.54; 9 10.16,0; 10 10.16,2.54; 11 12.7,0; 12 12.7,2.54; 13 15.24,0; 14 15.24,2.54; 15 17.78,0; 16 17.78,2.54; 17 20.32,0; 18 20.32,2.54; 19 22.86,0; 20 22.86,2.54; 21 25.4,0; 22 25.4,2.54; 23 27.94,0; 24 27.94,2.54; 25 30.48,0; 26 30.48,2.54; 27 33.02,0; 28 33.02,2.54; 29 35.56,0; 30 35.56,2.54; 31 38.1,0; 32 38.1,2.54; 33 40.64,0; 34 40.64,2.54; 35 43.18,0; 36 43.18,2.54; 37 45.72,0; 38 45.72,2.54; 39 48.26,0; 40 48.26,2.54
SSOP28 = smd 0.4 x 1.5: 1 -4.225,-3.625; 2 -3.575,-3.625; 3 -2.925,-3.625; 4 -2.275,-3.625; 5 -1.625,-3.625; 6 -0.975,-3.625; 7 -0.325,-3.625; 8 0.325,-3.625; 9 0.975,-3.625; 10 1.625,-3.625; 11 2.275,-3.625; 12 2.925,-3.625; 13 3.575,-3.625; 14 4.225,-3.625; 15 4.225,3.625; 16 3.575,3.625; 17 2.925,3.625; 18 2.275,3.625; 19 1.625,3.625; 20 0.975,3.625; 21 0.325,3.625; 22 -0.325,3.625; 23 -0.975,3.625; 24 -1.625,3.625; 25 -2.275,3.625; 26 -2.925,3.625; 27 -3.575,3.625; 28 -4.225,3.625
SOIC8 = smd 1.524 x 0.66: 1 -2.973,1.905; 2 -2.973,0.635; 3 -2.973,-0.635; 4 -2.973,-1.905; 5 2.973,-1.905; 6 2.973,-0.635; 7 2.973,0.635; 8 2.973,1.905
TSSOP-16 = smd 1.5 x 0.45: 1 -2.9,2.275; 2 -2.9,1.625; 3 -2.9,0.975; 4 -2.9,0.325; 5 -2.9,-0.325; 6 -2.9,-0.975; 7 -2.9,-1.625; 8 -2.9,-2.275; 9 2.9,-2.275; 10 2.9,-1.625; 11 2.9,-0.975; 12 2.9,-0.325; 13 2.9,0.325; 14 2.9,0.975; 15 2.9,1.625; 16 2.9,2.275
SOT-23-5 = smd 1 x 0.55: 1 -1.35,0.95; 2 -1.35,0; 3 -1.35,-0.95; 4 1.35,-0.95; 5 1.35,0.95
LQFP32 = smd 1.5 x 0.55: 1 -4.45,2.8; 2 -4.45,2; 3 -4.45,1.2; 4 -4.45,0.4; 5 -4.45,-0.4; 6 -4.45,-1.2; 7 -4.45,-2; 8 -4.45,-2.8; 17 4.45,-2.8; 18 4.45,-2; 19 4.45,-1.2; 20 4.45,-0.4; 21 4.45,0.4; 22 4.45,1.2; 23 4.45,2; 24 4.45,2.8 | smd 0.55 x 1.5: 9 -2.8,-4.45; 10 -2,-4.45; 11 -1.2,-4.45; 12 -0.4,-4.45; 13 0.4,-4.45; 14 1.2,-4.45; 15 2,-4.45; 16 2.8,-4.45; 25 2.8,4.45; 26 2,4.45; 27 1.2,4.45; 28 0.4,4.45; 29 -0.4,4.45; 30 -1.2,4.45; 31 -2,4.45; 32 -2.8,4.45
JST-B2B-XH-A = drill 0.9: 1 -1.25,0; 2 1.25,0
JST-B4B-XH-A = drill 0.9: 1 -3.75,0; 2 -1.25,0; 3 1.25,0; 4 3.75,0
XT60PW-M-V = drill 4.4: + -3.6,0; - 3.6,0
PCI-SLOT = drill 1: A1 -38.735,3.81; A2 -37.465,1.27; A3 -36.195,3.81; A4 -34.925,1.27; A5 -33.655,3.81; A6 -32.385,1.27; A7 -31.115,3.81; A8 -29.845,1.27; A9 -28.575,3.81; A10 -27.305,1.27; A11 -26.035,3.81; A14 -22.225,1.27; A15 -20.955,3.81; A16 -19.685,1.27; A17 -18.415,3.81; A18 -17.145,1.27; A19 -15.875,3.81; A20 -14.605,1.27; A21 -13.335,3.81; A22 -12.065,1.27; A23 -10.795,3.81; A24 -9.525,1.27; A25 -8.255,3.81; A26 -6.985,1.27; A27 -5.715,3.81; A28 -4.445,1.27; A29 -3.175,3.81; A30 -1.905,1.27; A31 -0.635,3.81; A32 0.635,1.27; A33 1.905,3.81; A34 3.175,1.27; A35 4.445,3.81; A36 5.715,1.27; A37 6.985,3.81; A38 8.255,1.27; A39 9.525,3.81; A40 10.795,1.27; A41 12.065,3.81; A42 13.335,1.27; A43 14.605,3.81; A44 15.875,1.27; A45 17.145,3.81; A46 18.415,1.27; A47 19.685,3.81; A48 20.955,1.27; A49 22.225,3.81; A50 23.495,1.27; A51 24.765,3.81; A52 26.035,1.27; A53 27.305,3.81; A54 28.575,1.27; A55 29.845,3.81; A56 31.115,1.27; A57 32.385,3.81; A58 33.655,1.27; A59 34.925,3.81; A60 36.195,1.27; A61 37.465,3.81; A62 38.735,1.27; B1 -38.735,-1.27; B2 -37.465,-3.81; B3 -36.195,-1.27; B4 -34.925,-3.81; B5 -33.655,-1.27; B6 -32.385,-3.81; B7 -31.115,-1.27; B8 -29.845,-3.81; B9 -28.575,-1.27; B10 -27.305,-3.81; B11 -26.035,-1.27; B14 -22.225,-3.81; B15 -20.955,-1.27; B16 -19.685,-3.81; B17 -18.415,-1.27; B18 -17.145,-3.81; B19 -15.875,-1.27; B20 -14.605,-3.81; B21 -13.335,-1.27; B22 -12.065,-3.81; B23 -10.795,-1.27; B24 -9.525,-3.81; B25 -8.255,-1.27; B26 -6.985,-3.81; B27 -5.715,-1.27; B28 -4.445,-3.81; B29 -3.175,-1.27; B30 -1.905,-3.81; B31 -0.635,-1.27; B32 0.635,-3.81; B33 1.905,-1.27; B34 3.175,-3.81; B35 4.445,-1.27; B36 5.715,-3.81; B37 6.985,-1.27; B38 8.255,-3.81; B39 9.525,-1.27; B40 10.795,-3.81; B41 12.065,-1.27; B42 13.335,-3.81; B43 14.605,-1.27; B44 15.875,-3.81; B45 17.145,-1.27; B46 18.415,-3.81; B47 19.685,-1.27; B48 20.955,-3.81; B49 22.225,-1.27; B50 23.495,-3.81; B51 24.765,-1.27; B52 26.035,-3.81; B53 27.305,-1.27; B54 28.575,-3.81; B55 29.845,-1.27; B56 31.115,-3.81; B57 32.385,-1.27; B58 33.655,-3.81; B59 34.925,-1.27; B60 36.195,-3.81; B61 37.465,-1.27; B62 38.735,-3.81 | hole 2.44: -24.13,0; 40.64,0
G5LE = drill 1.321 long: 1 -7.493,-5.969; 2 -7.493,5.969; O 4.699,5.969; P -9.525,0; S 4.699,-5.969
INDUCTOR-5045 = smd 4 x 1.5: 1 0,1.8; 2 0,-1.8
LED-0603 = smd 0.762 x 0.762: A -0.762,0; C 0.762,0
SOT23-3 = smd 0.8 x 0.9: 1 -0.95,-1; 2 0.95,-1; 3 0,1.1
R0603 = smd 0.762 x 0.762: 1 -0.762,0; 2 0.762,0
PIEZO-9.6X9.6-SMT = smd 2.6 x 2.4: 1 -4.5,0; 2 4.5,0
MSOP10 = smd 1 x 0.25: 1 -2.113,1; 2 -2.113,0.5; 3 -2.113,0; 4 -2.113,-0.5; 5 -2.113,-1; 6 2.113,-1; 7 2.113,-0.5; 8 2.113,0; 9 2.113,0.5; 10 2.113,1
USB-C-VERT = smd 0.15 x 0.75: A1 -2.75,0.725; A2 -2.25,0.725; A3 -1.75,0.725; A4 -1.25,0.725; A5 -0.75,0.725; A6 -0.25,0.725; A7 0.25,0.725; A8 0.75,0.725; A9 1.25,0.725; A10 1.75,0.725; A11 2.25,0.725; A12 2.75,0.725; B1 2.75,-0.725; B2 2.25,-0.725; B3 1.75,-0.725; B4 1.25,-0.725; B5 0.75,-0.725; B6 0.25,-0.725; B7 -0.25,-0.725; B8 -0.75,-0.725; B9 -1.25,-0.725; B10 -1.75,-0.725; B11 -2.25,-0.725; B12 -2.75,-0.725 | drill 0.5 pad 0.7 long: FIX1 -2.4,-2.15; FIX2 -2.4,2.15; FIX3 2.4,2.15; FIX4 2.4,-2.17 | hole 0.6: 3.7,0; -3.75,0
HSOIC8 = smd 1.524 x 0.66: 1 -2.973,1.905; 2 -2.973,0.635; 3 -2.973,-0.635; 4 -2.973,-1.905; 5 2.973,-1.905; 6 2.973,-0.635; 7 2.973,0.635; 8 2.973,1.905 | smd 2.4 x 3.1: TGND 0,0
SOT23-5 = smd 0.55 x 1.2: 1 -0.95,-1.3; 2 0,-1.3; 3 0.95,-1.3; 4 0.95,1.3; 5 -0.95,1.3

### Placement (x,y rotation side)
C1  41,61 90 top
C2  138,10 270 top
C3  114,37 270 top
C4  139,14 180 top
C5  85,42 270 top
C6  143,27 180 top
C7  49,10 90 top
C8  107,27 180 top
C9  149,17 270 top
C10  150,37 270 top
C11  54,61 270 top
C12  48,61 270 top
C13  121,14 180 top
C14  76,32 0 top
C15  125,27 180 top
C16  121,20 180 top
C17  131,17 270 top
C18  49,25 270 top
C19  120,10 270 top
C20  139,20 180 top
C21  139,16 180 top
C22  139,18 180 top
C23  108,20 180 top
C24  121,18 180 top
C25  132,37 270 top
C26  104,16 180 top
C27  104,20 180 top
C28  73,30 180 top
C29  82,32 0 top
C30  79,32 180 top
C31  62,46 180 top
C32  62,40 180 top
C34  85,36 270 top
C35  85,39 90 top
C36  67,40 180 top
C37  81,48 0 top
C38  67,36 180 top
C39  121,16 180 top
C40  104,18 180 top
C41  85,45 90 top
D1  138,39 0 top
D3  120,39 0 top
D4  102,39 0 top
F1  124,67 180 top
F2  107,67 180 top
F3  37,17 270 top
FID1  146,54 0 top
FID2  46,10 0 top
FID3  26.02,45 270 top
H1  114,9 180 top
IC1  77,62 270 top
IC2  66,62 270 top
IC3  70,20 0 top
IC4  128,37 90 top
IC5  110,37 90 top
IC6  146,37 90 top
IC7  68,32 0 top
IC8  77,40 0 top
J1  5,62 90 top
J2  5,46 90 top
J3  26,17 270 top
J10  76,75 180 top
K1  143,54 90 top
K2  125,54 90 top
K3  107,54 90 top
L1  145,18 270 top
L2  127,18 270 top
LED1  142,74 180 top
LED2  10,74 180 top
LED3  130,74 180 top
LED4  136,74 180 top
LED5  16,74 180 top
LED6  22,74 180 top
Q1  33,61 270 top
Q2  137,35 90 top
Q3  119,35 90 top
Q4  101,35 90 top
Q6  33,57 270 top
R1  47,56 270 top
R2  45,56 270 top
R3  36,57 90 top
R4  30,57 90 top
R5  36,61 270 top
R6  30,61 90 top
R7  57,56 0 top
R8  142,71 180 top
R9  51,56 0 top
R10  10,71 180 top
R11  143,8 0 top
R12  16,71 180 top
R13  22,71 180 top
R14  89,45 270 top
R15  140,9 90 top
R16  147,8 0 top
R17  89,42 90 top
R18  87,42 270 top
R19  87,45 90 top
R20  62,48 0 top
R21  10,64 90 top
R23  76,21 90 top
R24  10,60 90 top
R25  76,17 270 top
R26  99,14 180 top
R29  140,35 270 top
R30  142,35 270 top
R31  122,35 270 top
R32  124,35 270 top
R33  104,35 270 top
R34  106,35 270 top
R35  125,8 0 top
R36  129,8 0 top
R37  122,9 90 top
R38  130,71 180 top
R39  136,71 180 top
R41  68,29 180 top
R42  73,32 180 top
R43  76,30 0 top
R44  82,30 0 top
R45  79,30 180 top
R46  82,28 180 top
R47  79,28 0 top
R48  62,42 0 top
R49  62,44 0 top
R50  87,39 90 top
R51  87,36 270 top
R52  73,28 0 top
R53  76,28 180 top
R54  89,36 90 top
R55  89,39 270 top
R56  67,38 180 top
SPKR2  26,42 180 top
U1  44,61 90 top
U2  57,61 90 top
U3  51,61 90 top
U$9  57,43 90 top
VR1  145,12 0 top
VR2  108,17 90 top
VR3  127,12 0 top

### Tracks (layer width: path | path; a pad name or v marks a point on that pad's centre or on a via)
3.3V  (via drill 0.35)
  Top 0.254: 30.19,57.95 R4.2 v30,59 | 30.19,61.95 R6.2 v30,63 | IC6.10 147.62,37.38 v148,37 148.76,37.76 C10.1
  Top 0.305: Q6.1 30.19,57.95 | Q1.1 30.19,61.95 | IC4.10 129.62,38.38 129.62,37.38 v130,37 | R10.2 v8,71 | IC8.22 79.2,41.2 79,41 v79,40 79,39 | IC8.18 80,38 79,39 | C37.1 v79,48 IC8.26 | IC8.26 IC8.25 | IC8.14 78.2,38.2 79,39 | C36.1 69.1,41.2 IC8.3 73.8,41.2 74.8,41.2 v75,41 75,40 75,38 IC8.10 | R56.2 v65,38 | R20.1 v60,48 | R21.2 v10,66 | IC5.10 111.62,37.38 v112,37 112.76,37.76 C3.1 | v130,37 130.76,37.76 C25.1 | IC4.5 128.32,35.33 v130,37 | v76,23 R23.2 75.86,21.91 IC3.8 | IC2.9 63.98,61.02 v65,60 | IC1.9 71.53,61.02 v71.5,61 | IC2.15 69.5,57.65 v69.5,56.5 | R26.2 v97,14 | R25.2 v76,15 | IC7.4 69.35,29.59 R41.1 68.76,27.76 v68,27 | IC8.27 IC8.26
  pour Route2: 0.08,0.08 151.92,0.08 151.92,81.92 0.08,81.92
5V  (via drill 0.35, 0.5)
  Top 0.254: 50,61 48.76,61 C12.1 | 50,61 U3.1 | U1.1 43,60 42.76,60.24 C1.1 | R9.2 v53,56 | R7.2 v59,56 | R1.2 46.76,55 v46,55 45.24,55 R2.2 | U3.8 v51,61 50,61 | U2.8 v57,61 54.76,61 C11.1 | R5.2 v36,59 R3.2
  Top 0.305: R16.2 v149,8 | C1.1 v41,59 | 47,55 R1.2 | D4.C 104.15,46.15 107,49 111,49 112.97,47.03 K3.1 | D3.C 122.15,46.15 125,49 129,49 130.97,47.03 K2.1 | D1.C 140.15,46.15 143,49 147,49 148.97,47.03 K1.1 | R12.2 v14,71
  Top 0.406: 138.5,27.25 C6.+
  Top 0.813: 143,19 143,18.2 L1.2 v141,18 C22.1 | C4.1 C21.1 C22.1 | C22.1 C20.1 139.9,26.9 140,27 139.75,27.25 138.5,27.25
  Bottom 0.305: v149,8 144,8 141,11 v141,18
  pour Route15: 0.08,0.08 151.92,0.08 151.92,81.92 0.08,81.92
!USB_RESET
  Top 0.305: IC8.4 71.4,40.4 70,39 69,38 R56.1 C38.1
CLK
  Top 0.305: IC8.5 71.6,39.6 71,39 69.35,37.35 IC7.5
DAC0
  Top 0.254: U1.6 45,64.6 48.5,68.1 50,69.6 50,71.3 50,71.8 51,72.8 51.3,73.1 51.3,73.7 51.3,74.3 50.6,75 49.33,76.27 J10.B53
DAC1
  Top 0.254: U1.7 44.5,65.5 46,67 48.7,69.69 J10.A53
DAC2
  Top 0.254: J10.B54 47.42,75.62 48.7,74.35 48.7,73.9 48.7,73 48.5,72.8 47.4,71.7 47.4,71.2 47.4,69.9 46.7,69.2 44,66.5 U1.8
DAC3
  Top 0.254: U1.9 43.5,65.4 43.5,68.2 44.7,69.4 44.9,69.6 44.9,71.1 44.9,71.9 45.3,72.3 46.73,73.73 J10.A54
DM0
  Top 0.305: C32.1 R48.2 IC8.2
DM1
  Top 0.305: R52.2 C28.1 R42.1 73.76,32.76 75,34 75.8,34.8 IC8.11
DM2
  Top 0.305: R47.2 R45.1 C30.1 79.76,33.24 79,34 IC8.15
DM3
  Top 0.305: IC8.19 82.2,38.8 83,38 84.24,36.76 C34.1 R51.1 R54.2
DM4
  Top 0.305: R17.2 R18.1 C5.1 84.76,42.76 84,42 IC8.23
DP0
  Top 0.305: IC8.1 63.96,42.8 R49.2 C31.1 R20.2
DP1
  Top 0.305: IC8.12 76.6,34.6 76,34 75.24,33.24 C14.1 R43.1 R53.2
DP2
  Top 0.305: R46.2 R44.1 C29.1 81.24,32.76 80,34 79.8,34.2 IC8.16
DP3
  Top 0.305: R55.2 R50.1 C35.1 84.76,38.24 84,39 83.4,39.6 IC8.20
DP4
  Top 0.305: IC8.24 82.8,42.8 83,43 84.24,44.24 C41.1 R19.1 R14.2
DUT_3V3  (via drill 0.35)
  Top 0.305: v128,71 R38.2
  Top 0.61: F2.2 103,67 100,70 100,71 100,71.8 101.4,73.2 101.8,73.6 102,73.8 102,74.2 102,74.4 102.2,74.6 102.2,76.11 J10.B11 J10.B10
  Bottom 0.305: J10.B10 105.5,81 126,81 128,79 v128,71
DUT_3V3_RAW
  Top 0.305: IC5.12 110.33,38.33 109.03,37.02 IC5.3
  Top 0.508: IC5.3 IC5.2 IC5.1
  Top 0.813: VR2.5 106.65,16 C26.1 C40.1 C27.1 104.9,22.1 102.75,24.25 C8.+
  Top 1.27: C8.+ 103.75,27 108.38,31.62 IC5.2
DUT_5V
  Top 0.305: R39.2 135,71 133,69 124,69 122.5,67.5 F1.2
  Top 1.27: F1.2 122,67 118,71 118,79 116.17,80.83 108,80.83 107.87,80.83 J10.B8 J10.B9
DUT_5V_RAW  (via drill 0.35, 0.5)
  Top 0.305: IC4.12 128.32,38.33 127.03,37.02 IC4.3 | R36.2 v131,8
  Top 0.508: IC4.3 IC4.2 IC4.1 | VR2.3 111.05,17.95 111.5,17.5 111.5,16.5 111.05,16.05 VR2.1
  Top 0.813: L2.2 v123,18 C24.1 | C24.1 C16.1 121.9,23.1 120.75,24.25 C15.+ | 121.9,26.9 122,27 C15.+ | C24.1 C39.1 C13.1 | VR2.3 109.3,19.6 C23.1 113,20 116,23 116,26 117,27 C15.+
  Top 1.27: C15.+ 121.75,27 126.38,31.62 IC4.2
  Bottom 0.305: v131,8 126,8 123,11 v123,18
DUT_VIN
  Top 0.305: R8.2 141.24,62.76 145.3,58.7 K1.S
  Bottom 1.27: J10.B6 J10.B4 J10.B2 113.73,77.54 J10.B1 J10.B3 J10.B5 J10.B7
  Bottom 2.54: J10.B1 123,68 136,68 145.3,58.7 K1.S
GND  (via drill 0.35, 0.5)
  Top 0.508: VR2.2 v108,17
  Top 0.813: 26,10 J3.- 26,17
  Top 1.27: 31,14 30.4,13.4 J3.- 21.6,13.4 21,14
  Top 2.54: 147,29.1 147,24 | 111.25,25.25 111.25,29.75 | 45.25,29.25 C18.- 53.75,29.25 | 44.75,5.75 C7.- 53.25,5.75
  Bottom 0.813: 26,17 J3.- 26,10
  Bottom 1.27: 31,14 30.4,13.4 J3.- 22.6,13.4 22,14
  other vias: 149,70 109,25 109,29 51,8 47,8 145,25 145,29 148.5,29 112.5,25 112.5,29 148.5,25 144,11 146,11 146,13 144,13 149,73 138,22 120,22 127,29 127,25 130,25 130,29 128,13 128,11 126,11 126,13 47,27 51,27 47,31 51,31 51,4 47,4
  pour Top: 0.08,0.08 151.92,0.08 151.92,81.92 0.08,81.92
  pour Bottom: 0.08,0.08 151.92,0.08 151.92,81.92 0.08,81.92
GPIO0  (via drill 0.35)
  Top 0.305: IC1.21 79.67,61.67 v78,60
  Route15 0.305: v78,60 83,65 83,71 83,71.7 82.1,72.6 81.8,72.9 81.8,74.1 81.8,74.3 80.9,75.2 80.44,75.66 J10.B28
GPIO1
  Top 0.305: IC1.22 81.83,62.33 82,62.5 82,65.5 82,68.5 81,69.5 80.44,70.06 J10.A28
GPIO2  (via drill 0.35)
  Top 0.305: IC1.23 79.47,62.98 v78,61.5
  Route15 0.305: v78,61.5 82,65.5 82,67.2 82,68.6 80.9,69.7 80.5,70.1 80.5,71.3 80.5,71.8 79.7,72.6 79.17,73.12 J10.B29
GPIO3  (via drill 0.35)
  Top 0.305: IC1.24 78.62,63.62 v78,63
  Route15 0.305: v78,63 79.9,64.9 79.9,67 79.9,70.47 J10.A29
GPIO4  (via drill 0.35)
  Top 0.305: IC1.25 78.22,64.28 v78,64.5
  Route15 0.305: v78,64.5 78,70 78,71.5 78,72 77,73 76.6,73.4 76.6,73.9 76.6,74.3 77.4,75.1 77.91,75.61 J10.B30
GPIO5
  Top 0.305: J10.A30 77.91,66.09 79.08,64.92 IC1.26
GPIO6  (via drill 0.35)
  Top 0.305: IC1.27 79.42,65.58 79,66 v79,67.5
  Route2 0.305: v79,67.5 78,68.5 77.9,68.6 77.9,70.9 77.9,71.8 77.1,72.6 76.64,73.06 J10.B31
GPIO7  (via drill 0.35)
  Top 0.305: IC1.28 80.62,67.62 v81,68
  Bottom 0.305: v81,68 79.5,69.5 77.5,69.5 76.64,70.36 J10.A31
GPIO8
  Top 0.305: IC1.1 74.22,66.22 74.5,66.5 75.4,67.4 75.4,71.4 75.4,71.7 74.6,72.5 74.09,73 J10.B33
GPIO9
  Top 0.305: IC1.2 72.42,65.58 72,66 72,66.5 72,67.5 72.7,68.2 74.09,69.59 J10.A33
GPIO10  (via drill 0.35)
  Top 0.305: IC1.3 74.92,64.92 75.5,65.5 v75.5,66
  Bottom 0.254: v75.5,66 75.5,67 75.5,71.6 74.3,72.8 74.1,73 74.1,73.8 74.1,74.3 73.2,75.2 72.83,75.58 J10.B34
GPIO11  (via drill 0.35)
  Top 0.305: IC1.4 75.78,64.28 v76,64.5
  Route2 0.254: v76,64.5 75,64.5 74.5,65 72.83,66.67 J10.A34
GPIO12  (via drill 0.35)
  Top 0.305: IC1.5 75.38,63.62 v76,63
  Bottom 0.254: v76,63 73,66 72.9,66.1 72.9,71 72.9,71.7 71.9,72.7 71.56,73.05 J10.B35
GPIO13  (via drill 0.35)
  Top 0.305: IC1.6 74.53,62.98 v76,61.5
  Route2 0.254: v76,61.5 73.5,64 71.56,65.94 J10.A35
GPIO14  (via drill 0.35)
  Top 0.254: IC1.7 74.17,62.33 75,61.5 75,61 v76,60
  Bottom 0.254: v76,60 74.5,61.5 74.5,62.5 70.5,66.5 70.5,67.5 70.3,67.7 70.3,71.8 69.4,72.7 69,73.1 69,74.3 69.8,75.1 70.28,75.58 J10.B36
GPIO15  (via drill 0.35)
  Top 0.305: IC1.8 72.33,61.67 71.9,62.1 v71.9,62.5
  Route2 0.305: v71.9,62.5 70.28,64.11 J10.A36
GPIO16  (via drill 0.35)
  Top 0.305: IC2.21 67.17,61.67 v67,61.5
  Bottom 0.305: v67,61.5 69,63.5 69,65.5 69,68.5 68,69.5 67.7,69.8 67.7,70.9 67.7,71.8 66.9,72.6 66.5,73 66.5,73.8 66.5,74.4 67.2,75.1 67.75,75.64 J10.B38
GPIO17
  Top 0.305: J10.A38 67.75,70.25 69,69 71,67 71,63 71,62.5 70.83,62.33 IC2.22
GPIO18  (via drill 0.35)
  Top 0.305: IC2.23 65.97,62.98 v65,62
  Route2 0.305: v65,62 63.5,62 63,62.5 62.7,62.8 62.7,70.6 62.7,71.9 63.6,72.8 63.9,73.1 63.9,73.5 63.9,74.3 64.5,74.9 65.87,76.27 J10.B39
GPIO19  (via drill 0.35)
  Top 0.305: IC2.24 64.62,63.62 v64.5,63.5
  Route2 0.305: v64.5,63.5 64.5,69.22 J10.A39
GPIO20
  Top 0.305: IC2.25 65.72,64.28 64.5,65.5 64.5,66.5 64.5,67.5 63,69 62.7,69.3 62.7,70.7 62.7,71.8 63.9,73 63.9,73.8 63.9,74.3 64.7,75.1 65.2,75.61 J10.B40
GPIO21
  Top 0.305: J10.A40 65.2,66.3 66,65.5 66.58,64.92 IC2.26
GPIO22  (via drill 0.35)
  Top 0.305: IC2.27 67.42,65.58 v67,66
  Bottom 0.305: v67,66 65.5,67.5 62.7,70.3 62.7,71.2 62.7,71.8 63.5,72.6 63.94,73.03 J10.B41
GPIO23  (via drill 0.35)
  Top 0.305: IC2.28 68.78,66.22 v67.5,67.5
  Bottom 0.305: v67.5,67.5 63.94,71.06 J10.A41
IO0_EEPROM_SDA
  Top 0.305: IC3.5 75.67,18.09 R25.1 76.24,18 79,18 80.98,16.02 H1.27
  Route2 0.305: J10.B17 94.42,73.22 93.8,72.6 93.2,72 93.2,70.7 93.2,69.7 93.2,67.8 95,66 95,32 80.98,17.98 H1.27
IO1_EEPROM_SCL
  Top 0.305: IC3.6 75.13,19.36 R23.1 78.76,20.24 81,18 | 81,18 82.2,16.8 82.2,10.2 82.2,7.68 H1.28 | J10.B16 95.69,75.69 94.8,74.8 94.4,74.4 94.4,73.1 95.4,72.1 95.7,71.8 95.7,70.1 95.7,69.5 | 95.7,69.5 95.7,69.4 | 95.7,69.5 95.7,32.7 88,25 81,18
IO2_SDA  (via drill 0.35)
  Top 0.254: 30.19,60.05 R6.1 | 148.38,34 IC6.8 148.38,34 | 148.38,34 v150,34 | v132,34 130.38,34 IC4.8 | 112.38,34 IC5.8 112.38,34
  Top 0.305: Q1.2 30.19,60.05 | IC5.5 110.33,32.67 111,32 112,32 112.28,32.27 IC5.8 | v114,34 112.38,34 | v60.5,59 61.08,58.42 IC2.13 | v71.48,58.98 71.52,58.98 72.08,58.42 IC1.13 74.78,58.42 77.2,56 78.2,55 84,55 87,55 89,57 v89,58 | v28.5,60 28.74,60.24 R6.1
  Route2 0.305: v71.48,58.98 70.5,58 61.5,58 v60.5,59 59.5,58 58,58 42.5,58 42,57.5 38,53.5 29.5,53.5 29,53.5 27.5,55 27.5,59 v28.5,60
  Bottom 0.254: v150,34 v132,34 v114,34 | v114,34 111,34 104,41 104,52 104,60 98,66 94.42,69.58 J10.A17 | H1.3 111.46,12.96 | 114,31.5 v114,34
  Bottom 0.305: v89,58 91,60 91,66.17 94.42,69.58 | 111.46,12.96 114,15.5 114,31.5
IO3_SCL  (via drill 0.35)
  Top 0.254: 30.19,56.05 R4.1 | 148.38,40 IC6.9 148.38,40 | 112.38,40 IC5.9 112.38,40 | 130.38,40 IC4.9 130.38,40 | 148.38,40 v150,40 | v132,40 130.38,40 | v114,40 112.38,40
  Top 0.305: Q6.2 30.19,56.05 | v71.5,60 72.42,59.08 IC1.12 75.12,59.08 77.2,57 78.2,56 83,56 86,56 87,57 88,58 v88,61 | v60.5,60.5 61.27,59.73 61.27,59.38 61.57,59.08 IC2.12 | v30,55 R4.1
  Route2 0.305: v71.5,60 66.5,60 65.5,59 65,59 62,59 v60.5,60.5 59.5,60.5 58,59 47.5,59 42.5,59 41.5,58 38.5,55 v30,55
  Route15 0.254: H1.5 108.92,12.92 113.5,17.5 116,20 116,31.5 116,38 v114,40
  Bottom 0.254: v150,40 v132,40 v114,40 110,44 110,46 110,59 107,62 99,70 99,70.5 | J10.A16 96.64,72.77 97.23,72.77 97.5,72.5 99,71 99,70.5 | 99,70.67 99,70.5
  Bottom 0.305: v88,61 88,63 88,65 90,67 92,69 93.2,70.2 93.2,70.9 93.2,72 93.6,72.4 93.7,72.5 94.1,72.5 94.45,72.5 J10.A16
IO7_CE1
  Route15 0.305: J10.A23 86.8,39.8 82,35 82,24 82,12 82,11.2 82.1,11.1 82.2,11 82.2,9 82.2,7.78 H1.26
IO8_CE0  (via drill 0.35)
  Top 0.305: J10.B26 82.98,75.69 82.3,75 81.8,74.5 81.8,73.1 81.8,72.9 82.9,71.8 83,71.7 83,69.4 83,69 86,66 90,62 90,56 87,53 82,53 v80,53
  Bottom 0.305: H1.24 83.6,4 83,4 81,4 80,5 79.7,5.3 79.7,10.1 79.7,23.3 79,24 78,25 78,29 78,33 80,35 80,48 v80,53
IO9_MISO  (via drill 0.35)
  Top 0.305: J10.B24 85.53,75.62 84.7,74.8 84.3,74.4 84.3,73.1 85.3,72.1 85.5,71.9 85.5,69.4 85.5,68.5 91,63 91,55 87,51 v82,51
  Bottom 0.305: H1.21 87.4,7.8 85.8,7.8 83.2,7.8 83,7.8 82.3,8.5 82.3,10.5 82.3,26.7 82,27 v82,51
IO10_MOSI  (via drill 0.35)
  Route2 0.305: J10.B23 86.8,73.09 86.2,72.5 85.5,71.8 85.5,69.8 85.5,67.5 85.5,57.5 v85,57
  Bottom 0.305: v85,57 85,36 89,32 91.14,29.86 H1.19
IO11_SCK  (via drill 0.35)
  Route2 0.305: J10.B25 84.25,73.16 83.3,72.2 83,71.9 83,70 | 83,70 83,69.7 | 83,70 83,66 84,65 v84,58
  Bottom 0.305: v84,58 84,35 86.06,32.94 H1.23
IO14_IR_TXD
  Route15 0.305: H1.8 106.38,4.38 105,3 103,3 64,3 59,3 58,2 50,2 26,2 16,12 16,32 16,36 16,39 7.75,47.25 J2.3
IO15_IR_RXD
  Route15 0.305: H1.10 103.84,4.84 103,4 96,4 64,4 61,4 60,5 59,6 46,6 29,6 24,6 17,13 17,29 17,38 17,40 7.25,49.75 J2.4
IO17_DUT_VIN  (via drill 0.35)
  Top 0.305: v142,37 R30.1
  Route2 0.305: H1.11 101.3,11.3 102,12 104,14 110,14 114,18 116,20 116,24 123,31 124,32 136,32 137,32 v142,37
IO18_!TESTER_RST  (via drill 0.35)
  Top 0.305: IC1.18 v82.51,59.73 | H1.12 100,7.76 100,12 100,13.76 R26.1 100,14.24 v100,16 | v67,59 67.72,59.73 IC2.18
  Bottom 0.305: v82.51,59.73 80.79,58 78,58 68,58 v67,59 | v82.51,59.73 82.98,60.2 J10.A26 | v100,16 100,36 98,38 97,39 96,40 96,42 96,49 94,51 87,58 85.28,59.73 v82.51,59.73
IO20_EXT_BUTTON  (via drill 0.35)
  Top 0.305: v10,58 R24.1
  Bottom 0.305: H1.38 68.28,4.28 66,2 27,2 20,9 17,12 17,37 17,51 v10,58
IO22_DUT_3V3  (via drill 0.35)
  Top 0.305: H1.15 96.22,10.78 95,12 95,22 95,25 100,30 102,32 v105,32 | v106,37 R34.1
  Bottom 0.305: v105,32 105,36 v106,37
IO23_PIEZO  (via drill 0.35)
  Top 0.305: v34,42 SPKR2.1
  Route2 0.305: H1.16 96.22,4.22 94,2 57,2 40,2 32,10 32,24 32,40 v34,42
IO24
  Route15 0.305: J10.A24 86.8,75 88,75 93,75 93.8,75 94.4,74.4 94.4,73.1 95.7,71.8 95.7,69.5 95.7,69.3 96,69 96,47 96,16 95,15 95,11 95,7.78 H1.18
IO25
  Route15 0.305: J10.A25 84.25,69.75 86,68 86,40 81,35 81,32 81,24 81,16 81,12 80,11 79.7,10.7 79.7,9.3 79.7,5.3 80.2,4.8 86.1,4.8 86.94,4.8 H1.22
IO27_DUT_5V  (via drill 0.35)
  Top 0.305: v124,37 R32.1
  Route2 0.305: H1.13 98.76,10.76 100,12 105,17 105,19 105,28 108,31 109,32 115,32 119,32 v124,37
N$1
  Top 0.254: U2.2 56.5,56.26 R7.1
N$2
  Top 0.305: R10.1 LED2.A
N$3
  Top 0.305: C9.1 147.04,17.76 L1.1
  Top 0.813: VR1.8 146.8,15.08 L1.1
N$4
  Top 0.305: R12.1 LED5.A
N$5
  Top 0.305: R13.1 LED6.A
N$8
  Bottom 2.54: J3.+ 34.7,20.6 | 34.7,20.6 F3.1 | F3.2 35.5,20.6 34.7,20.6
N$9
  Top 0.305: J1.1 9.99,60.75 R24.2 R21.1
N$12
  Top 0.254: U3.2 50.5,56.26 R9.1
N$13
  Top 0.305: R15.2 140.33,10.1 VR1.4
N$14
  Top 0.305: Q4.3 99.9,38.95 D4.A 101.03,40.18 K3.2
N$15
  Top 0.305: IC4.14 IC4.15 IC4.16
  Top 1.27: IC4.15 126.38,43.1 K2.P
N$16
  Top 0.305: IC6.16 IC6.15 IC6.14
  Top 1.27: IC6.15 144.38,43.1 K1.P
N$17
  Top 0.305: K1.2 137.03,40.18 D1.A 135.9,38.95 Q2.3
N$18
  Top 0.305: R11.2 R16.1 146.24,8.36 VR1.5
N$19
  Top 0.305: VR1.7 149.63,12.63 150,13 150,15.24 C9.2
N$21
  Top 0.254: U1.4 44.5,57.26 R2.1
N$22
  Top 0.254: U1.5 45,58.76 R1.1
N$23
  Top 0.305: LED1.A R8.1
N$24
  Top 0.254: R29.2 R30.2
  Top 0.305: Q2.1 138.19,34.24 R29.2
N$25
  Top 0.61: F2.1 109.5,67 112.97,63.53 K3.S
N$26
  Top 1.27: K2.S 130.97,62.53 126.5,67 F1.1
N$27
  Top 0.305: Q3.3 117.9,38.95 D3.A 119.03,40.18 K2.2
N$28
  Top 0.305: R32.2 R31.2 120.19,34.24 Q3.1
N$32
  Top 0.305: R34.2 R33.2 102.19,34.24 Q4.1
N$34
  Top 0.305: IC5.14 IC5.15 IC5.16
  Top 1.27: IC5.15 108.38,43.1 K3.P
N$39
  Top 0.305: C17.1 129.04,17.76 L2.1
  Top 0.813: VR3.8 128.8,15.08 L2.1
N$40
  Top 0.305: VR3.4 122.33,10.1 R37.2
N$41
  Top 0.305: R35.2 R36.1 128.24,8.36 VR3.5
N$42
  Top 0.305: VR3.7 131.63,12.63 132,13 132,15.24 C17.2
N$43
  Top 0.305: LED4.A R39.1
N$44
  Top 0.305: LED3.A R38.1
N$46
  Top 0.305: R41.2 66.65,29.59 IC7.3
PG  (1 unrouted)
SCL_5V  (via drill 0.35)
  Top 0.254: Q6.3 34.86,56.24 R3.1 42.24,56.24 v43,57 43.5,57.5 U1.2 | U2.10 55.89,63 v55,63 | v49,63 49.89,63 U3.10
  Bottom 0.254: v55,63 v49,63 v43,57
SDA_5V  (via drill 0.35)
  Top 0.254: Q1.3 34.86,61.76 R5.1 37.76,61.76 v38,62 | U2.9 56.5,64.5 v56,65 | v50,65 50.5,64.5 U3.9 | U1.3 v44,61
  Bottom 0.254: v56,65 v50,65 48,65 v44,61 43,62 v38,62
USB1_D+
  Top 0.305: J10.B18 93.14,75.64 92,74.5 91.9,74.4 91.9,73.1 93.2,71.8 93.2,69.5 94.2,68.5 94.2,32.7 88.5,27 86,24.5 79,24.5 76.76,26.74 R53.1
USB1_D-  (via drill 0.35)
  Top 0.305: v71,28 R52.1
  Route2 0.305: J10.B19 91.88,73.17 90.6,71.9 90.6,70 | 90.6,70 90.6,69.7 | 90.6,70 90.6,66.4 93,64 93,47 93,34 90,31 89,30 77,30 73,30 v71,28
USB2_D+  (via drill 0.35)
  Top 0.305: v84,28 R46.1
  Route15 0.305: J10.A18 93.14,69.5 | 93.14,69.5 93.14,69.34 | 93.14,69.5 93.14,34.65 86.5,28 v84,28
USB2_D-  (via drill 0.35)
  Top 0.305: v80,26 79,26 78.24,26.76 R47.1
  Route2 0.305: J10.A19 91.88,67.12 94,65 94,33 91,30 87,26 84,26 v80,26
USB3_D+
  Top 0.305: J10.B20 90.61,75.7 89.7,74.8 89.3,74.4 89.3,73.2 90.3,72.2 90.6,71.9 90.6,70.7 90.6,69.4 92.6,67.4 93,67 93,65 93,41.5 92.6,41.1 91.26,39.76 R55.1
USB3_D-  (via drill 0.35)
  Top 0.305: v90.5,35.5 90.24,35.24 R54.1
  Route2 0.305: J10.B21 89.33,73.14 88.3,72.1 88,71.8 88,70.6 88,69.7 88,65 90.5,62.5 v90.5,35.5
USB4_D+  (via drill 0.35)
  Top 0.305: v89,47 R14.1
  Route15 0.305: J10.A20 90.61,69.41 90.61,48.6 v89,47
USB4_D-  (via drill 0.35)
  Top 0.305: v92,43 90.24,41.24 R17.1
  Route2 0.305: J10.A21 89.33,65.67 91,64 92,63 v92,43
USB_N  (via drill 0.35)
  Top 0.254: U$9.B7 59.25,42.75 v60,42 R48.1 | U$9.A7 54.75,43.25 v54,44
  Bottom 0.254: v54,44 58,44 59,43 v60,42
USB_P  (via drill 0.35)
  Top 0.254: U$9.B6 59.25,43.25 v60,44 R49.1 | U$9.A6 54.75,42.75 v54,42
  Route2 0.254: v54,42 58,42 v60,44
V+  (3 unrouted)
VIN+  (via drill 0.35)
  Top 0.305: IC6.12 146.32,38.33 145.03,37.02 IC6.3 | R13.2 v20,71
  Top 0.508: IC6.3 IC6.2 IC6.1
  Top 0.813: VR3.2 VR3.3 120.03,11.37 C19.1 | VR1.2 VR1.3 138.03,11.37 C2.1
  Top 1.27: C2.1 134.6,11.4 134,12 | C19.1 118.4,11.4 117,10 117,1.8 | IC6.2 144.38,32.38 143,31 142,31
  Top 2.54: F3.3 48.35,14.9 C7.+ | 142,31 136,31 134,29 134,12 134,4 131.8,1.8 117,1.8 63.2,1.8 50.75,14.25 C7.+ | C18.+ C7.+
  Bottom 0.305: F3.3 40.9,14.9 43,17 43,28 20,51 20,69 v20,71
  Bottom 2.54: F3.4 F3.3
VSENSE0
  Top 0.254: J10.B43 61.4,73 61,72.6 60.1,71.7 60.1,71.4 60.1,69.7 59.9,69.5 59.2,68.8 59.2,62.2 57.5,60.5 U2.4
VSENSE1
  Top 0.254: U2.5 58,60 59.9,61.9 59.9,67.2 59.9,68.2 60.5,68.8 61.4,69.69 J10.A43
VSENSE2  (via drill 0.35)
  Top 0.254: U2.6 v58,67
  Bottom 0.254: v58,67 60.1,69.1 60.1,71.4 60.1,71.7 58.8,73 58.8,74.3 59.6,75.1 60.12,75.62 J10.B44
VSENSE3  (via drill 0.35)
  Top 0.254: U2.7 57.5,65.5 v57,66
  Route2 0.254: v57,66 58.5,66 60.12,67.62 J10.A44
VSENSE4
  Top 0.254: U3.4 51.5,60 52.5,61 52.5,64.5 56.5,68.5 57.6,69.6 57.6,71.2 57.6,71.8 58.5,72.7 58.85,73.06 J10.B45
VSENSE5
  Top 0.254: U3.5 52,59.5 53,60.5 53,64 57.85,68.86 58.85,69.86 J10.A45
VSENSE6
  Top 0.254: U3.6 52,65 54,67 55,68 55,71.1 55,71.7 56.3,73 56.3,73.8 56.3,74.3 57.2,75.2 57.59,75.58 J10.B46
VSENSE7  (via drill 0.35)
  Top 0.254: U3.7 51.5,66 v53,67.5
  Bottom 0.254: v53,67.5 54,67.5 55.7,67.5 57.2,69 57.59,69.39 J10.A46

### Text on the board
tPlace: v2.0 | Tester Power | DUT Power | 3V3 | 5V | VIN | 3V3 | 5V | VIN | Ext Button | IR Camera | RXi | Testomatic | by Jon Oxer | TXo | GND | 3V3 | VIN: 12Vdc 10A / Max 60Vdc 10A | FUSE: 10A | SKU: TESTOMATIC
bPlace: (C)2024 SuperHouse Automation Pty Ltd | www.superhouse.tv/testomatic | Made in / Australia